# EAGLE design timelapse_cr_schematic (EAGLE 6.1)
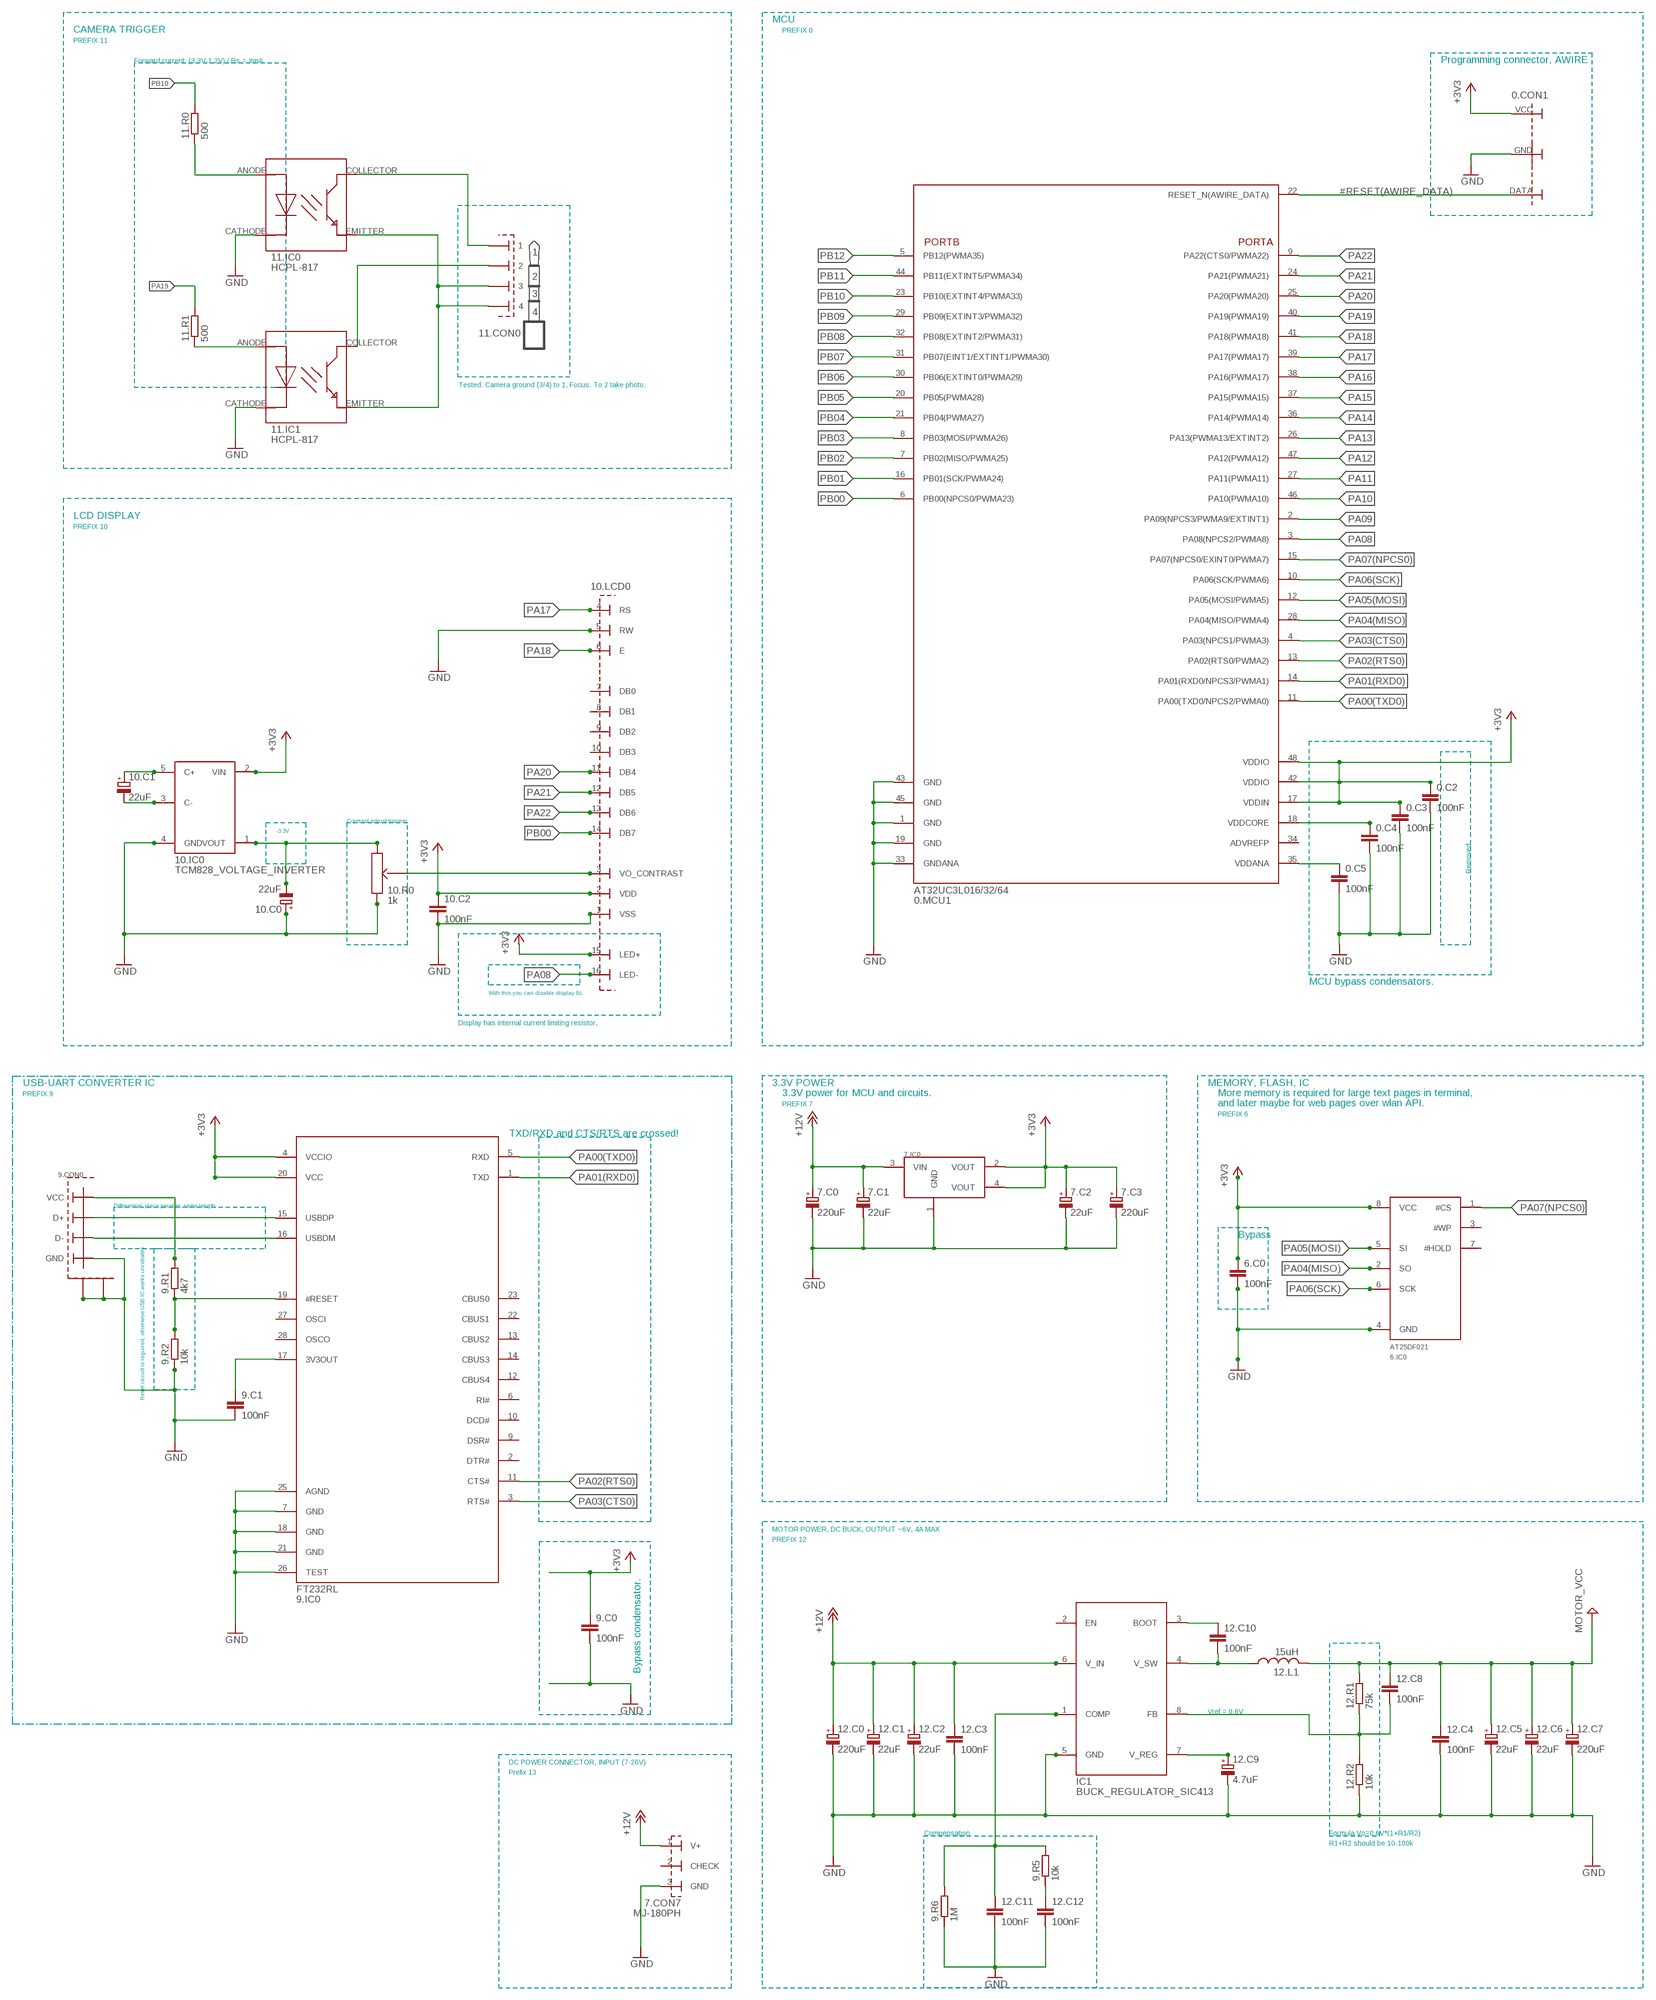
[diagram p0: schematic, sheet 1, part 1 of 2]
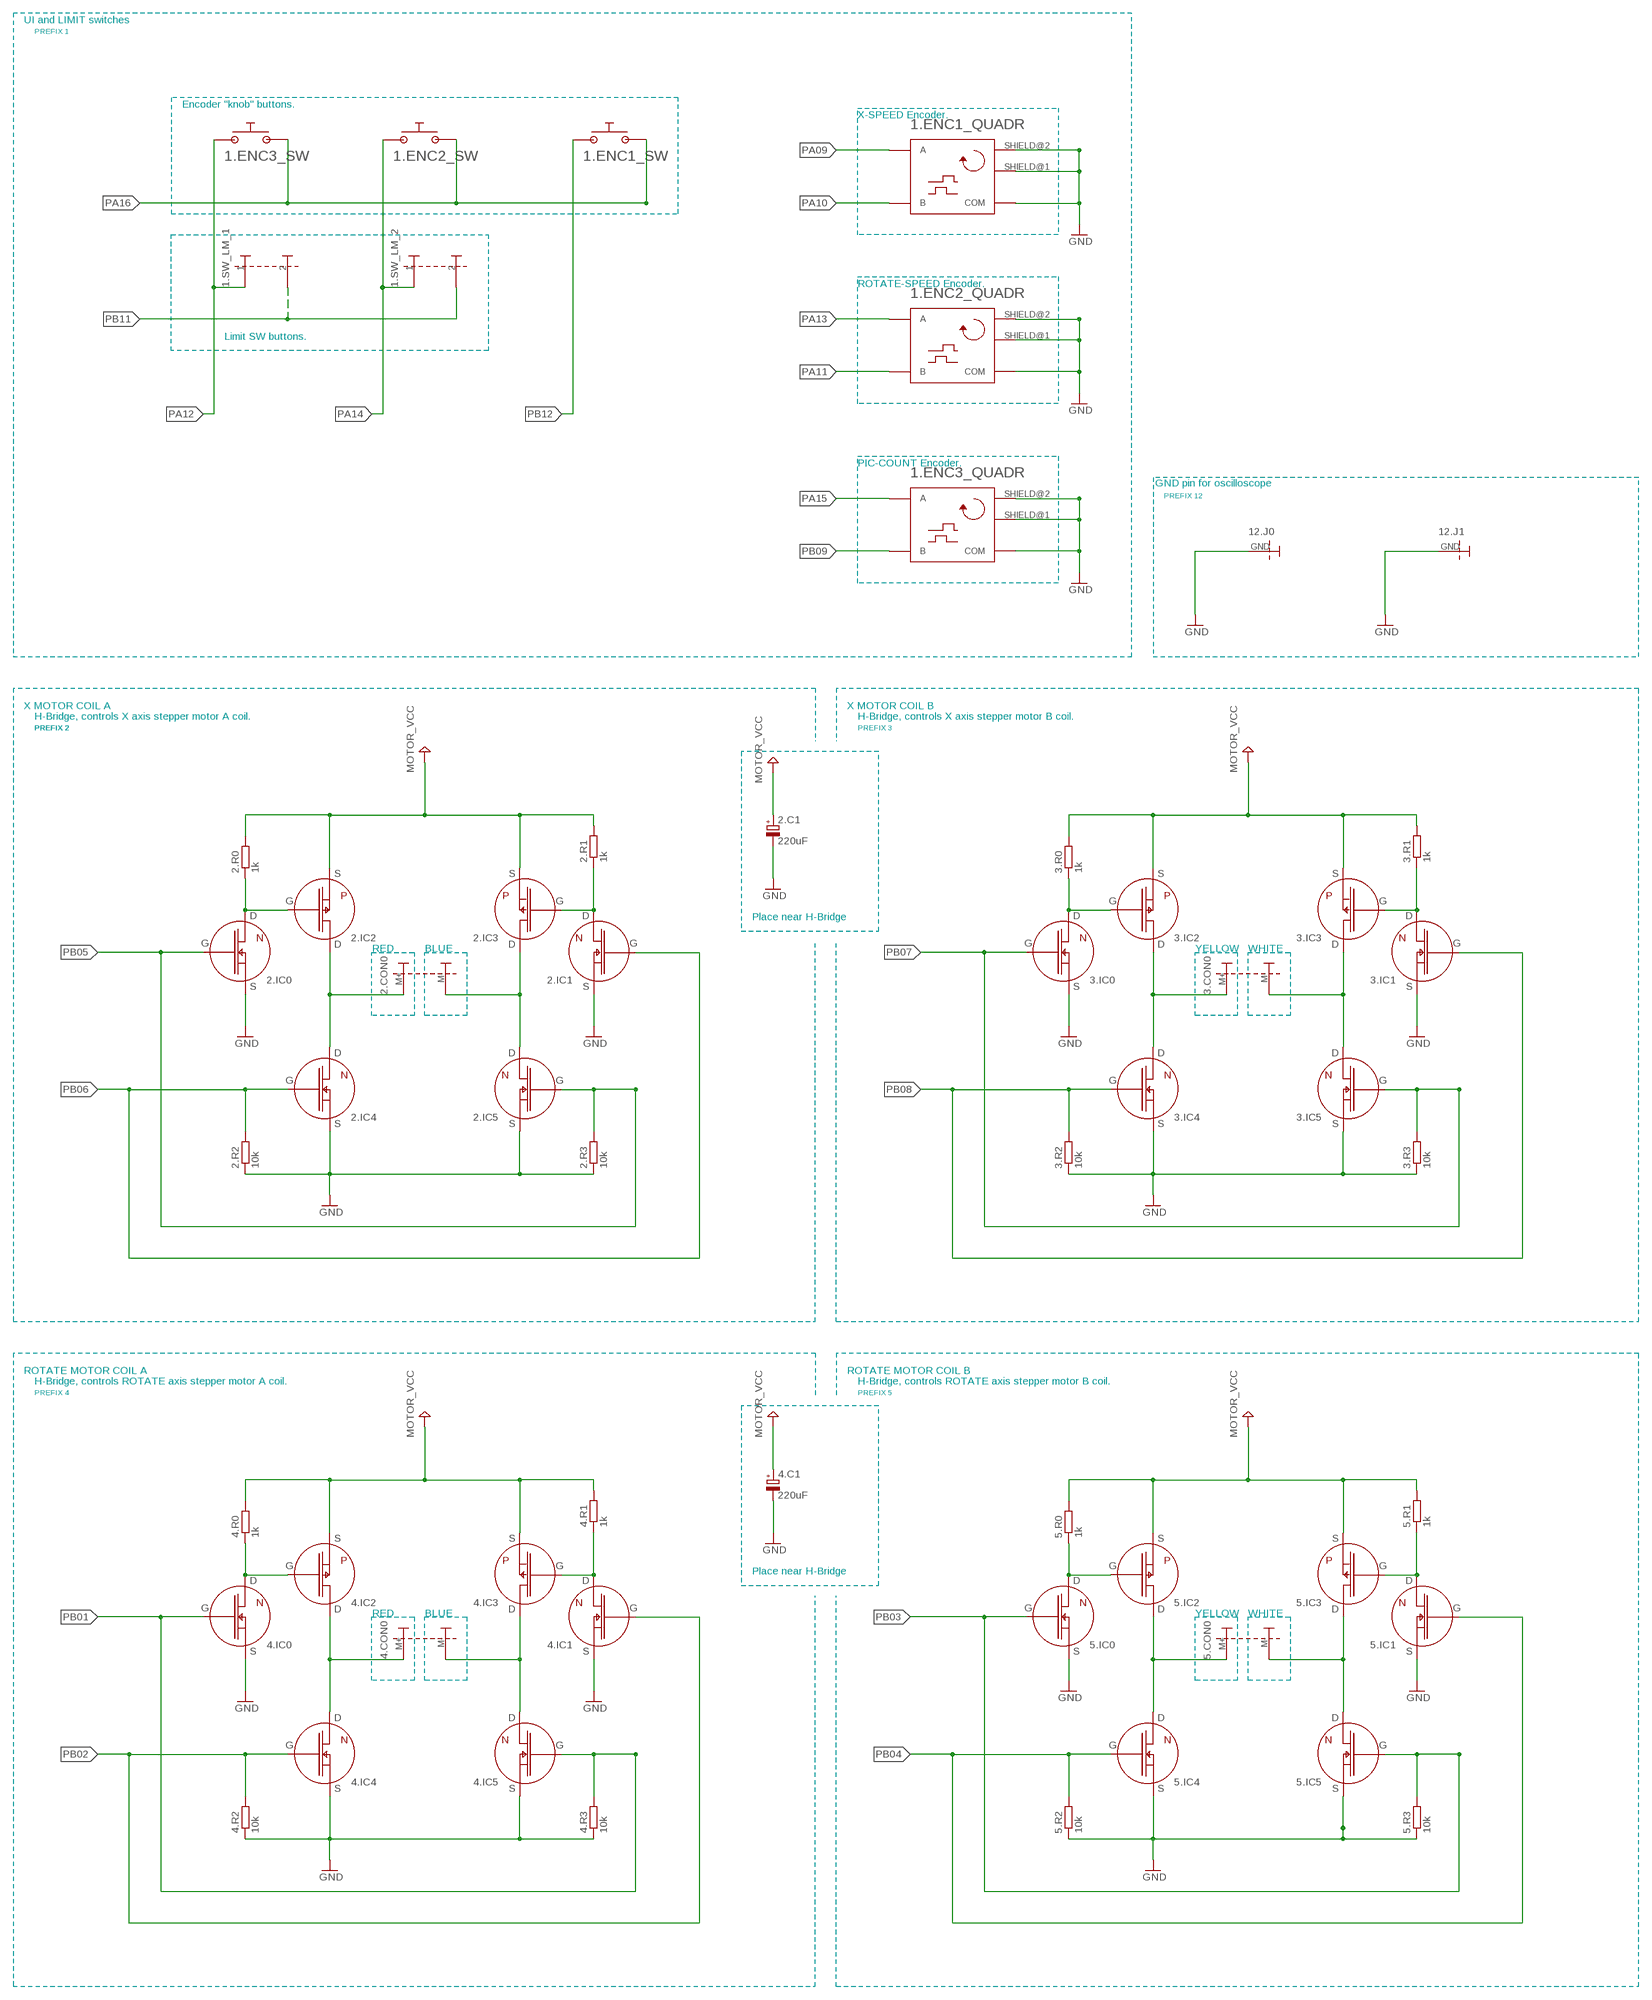
[diagram p1: schematic, sheet 1, part 2 of 2]

## Parts
0.C2  100nF  C-EUC0805  [C0805]
0.C3  100nF  C-EUC0805  [C0805]
0.C4  100nF  C-EUC0805  [C0805]
0.C5  100nF  C-EUC0805  [C0805]
0.CON1  CONNECTOR_3PINAWIRE  [1X3_AWIRE]
0.MCU1  AT32UCL016/32/64_TQFP48  [TQFP48]
1.ENC1  ENCODER_QUADRATE_WITH_BUTTON_ENCODER_PEC11-4XXXF-SXXXX  [ENCODER_PEC11-4XXXF-SXXXX]
1.ENC2  ENCODER_QUADRATE_WITH_BUTTON_ENCODER_PEC11-4XXXF-SXXXX  [ENCODER_PEC11-4XXXF-SXXXX]
1.ENC3  ENCODER_QUADRATE_WITH_BUTTON_ENCODER_PEC11-4XXXF-SXXXX  [ENCODER_PEC11-4XXXF-SXXXX]
1.SW_LM_1  CONNECTOR_2PIN  CONNECTOR_2PIN1X2_WIRE  [1X2_WIRE]
1.SW_LM_2  CONNECTOR_2PIN  CONNECTOR_2PIN1X2_WIRE  [1X2_WIRE]
2.C1  220uF  CPOL-EUE3.5-8  [E3,5-8]
2.CON0  CONNECTOR_2PIN1X2_MOTOR_COIL  [1X2_MOTOR_COIL_CONNECTOR]
2.IC0  N_MOSFET_TSM2N7002  [SOT23]
2.IC1  N_MOSFET_TSM2N7002  [SOT23]
2.IC2  P_MOSFET_NX2301P  [SOT23]
2.IC3  P_MOSFET_NX2301P  [SOT23]
2.IC4  N_MOSFET_PMV16UN  [SOT23]
2.IC5  N_MOSFET_PMV16UN  [SOT23]
2.R0  1k  R-EU_R0805  [R0805]
2.R1  1k  R-EU_R0805  [R0805]
2.R2  10k  R-EU_R0805  [R0805]
2.R3  10k  R-EU_R0805  [R0805]
3.CON0  CONNECTOR_2PIN1X2_MOTOR_COIL  [1X2_MOTOR_COIL_CONNECTOR]
3.IC0  N_MOSFET_TSM2N7002  [SOT23]
3.IC1  N_MOSFET_TSM2N7002  [SOT23]
3.IC2  P_MOSFET_NX2301P  [SOT23]
3.IC3  P_MOSFET_NX2301P  [SOT23]
3.IC4  N_MOSFET_PMV16UN  [SOT23]
3.IC5  N_MOSFET_PMV16UN  [SOT23]
3.R0  1k  R-EU_R0805  [R0805]
3.R1  1k  R-EU_R0805  [R0805]
3.R2  10k  R-EU_R0805  [R0805]
3.R3  10k  R-EU_R0805  [R0805]
4.C1  220uF  CPOL-EUE3.5-8  [E3,5-8]
4.CON0  CONNECTOR_2PIN1X2_MOTOR_COIL  [1X2_MOTOR_COIL_CONNECTOR]
4.IC0  N_MOSFET_TSM2N7002  [SOT23]
4.IC1  N_MOSFET_TSM2N7002  [SOT23]
4.IC2  P_MOSFET_NX2301P  [SOT23]
4.IC3  P_MOSFET_NX2301P  [SOT23]
4.IC4  N_MOSFET_PMV16UN  [SOT23]
4.IC5  N_MOSFET_PMV16UN  [SOT23]
4.R0  1k  R-EU_R0805  [R0805]
4.R1  1k  R-EU_R0805  [R0805]
4.R2  10k  R-EU_R0805  [R0805]
4.R3  10k  R-EU_R0805  [R0805]
5.CON0  CONNECTOR_2PIN1X2_MOTOR_COIL  [1X2_MOTOR_COIL_CONNECTOR]
5.IC0  N_MOSFET_TSM2N7002  [SOT23]
5.IC1  N_MOSFET_TSM2N7002  [SOT23]
5.IC2  P_MOSFET_NX2301P  [SOT23]
5.IC3  P_MOSFET_NX2301P  [SOT23]
5.IC4  N_MOSFET_PMV16UN  [SOT23]
5.IC5  N_MOSFET_PMV16UN  [SOT23]
5.R0  1k  R-EU_R0805  [R0805]
5.R1  1k  R-EU_R0805  [R0805]
5.R2  10k  R-EU_R0805  [R0805]
5.R3  10k  R-EU_R0805  [R0805]
6.C0  100nF  C-EUC0805  [C0805]
6.IC0  FLASH_AT25DF021_SO8  [SO8]
7.C0  220uF  CPOL-EUE3.5-8  [E3,5-8]
7.C1  22uF  CPOL-EUE1.5-5  [E1.5-5]
7.C2  22uF  CPOL-EUE1.5-5  [E1.5-5]
7.C3  220uF  CPOL-EUE3.5-8  [E3,5-8]
7.CON7  MJ-180PH  [MJ-180PH]
7.IC0  REGULATOR_AP1117E33G-13  [SOT223]
9.C0  100nF  C-EUC0805  [C0805]
9.C1  100nF  C-EUC0805  [C0805]
9.CON0  USB-BWUERTH-ELECTRONIC-USB-B  [USB-B-THROUGH-HOLE]
9.IC0  FT232RL  [SSOP28]
9.R1  4k7  R-EU_R0805  [R0805]
9.R2  10k  R-EU_R0805  [R0805]
9.R5  10k  R-EU_R0805  [R0805]
9.R6  1M  R-EU_R0805  [R0805]
10.C0  22uF  CPOL-EUE1.5-5  [E1.5-5]
10.C1  22uF  CPOL-EUE1.5-5  [E1.5-5]
10.C2  100nF  C-EUC0805  [C0805]
10.IC0  TCM828_VOLTAGE_INVERTER  [SOT23-5L]
10.LCD0  LCD_WITH_COMMON_INTERFACE_FDCC0802C-NSWBBH-91LE  [LCD_FDCC0802C-NSWBBH-91LE]
10.R0  1k  R-TRIMMER  [CT6V]
11.CON0  2.5MM-JACK-STEREO-CONNECTOR  [PSG01539]
11.IC0  HCPL-817  [HPCL-817]
11.IC1  HCPL-817  [HPCL-817]
11.R0  500  R-EU_R0805  [R0805]
11.R1  500  R-EU_R0805  [R0805]
12.C0  220uF  CPOL-EUE3.5-8  [E3,5-8]
12.C1  22uF  CPOL-EUE1.5-5  [E1.5-5]
12.C2  22uF  CPOL-EUE1.5-5  [E1.5-5]
12.C3  100nF  C-EUC0805  [C0805]
12.C4  100nF  C-EUC0805  [C0805]
12.C5  22uF  CPOL-EUE1.5-5  [E1.5-5]
12.C6  22uF  CPOL-EUE1.5-5  [E1.5-5]
12.C7  220uF  CPOL-EUE3.5-8  [E3,5-8]
12.C8  100nF  C-EUC0805  [C0805]
12.C9  4.7uF  CPOL-EUE1.5-5  [E1.5-5]
12.C10  100nF  C-EUC0805  [C0805]
12.C11  100nF  C-EUC0805  [C0805]
12.C12  100nF  C-EUC0805  [C0805]
12.J0  CONNECTOR_1PINGND_PIN  [1X1_GND_PIN]
12.J1  CONNECTOR_1PINGND_PIN  [1X1_GND_PIN]
12.L1  15uH  LMCBFS7330-150MU  [INDUCTOR_MCBFS7330]
12.R1  75k  R-EU_R0805  [R0805]
12.R2  10k  R-EU_R0805  [R0805]
IC1  BUCK_REGULATOR_SIC413  [SO8]

## Nets
#RESET(AWIRE_DATA): 0.CON1.DATA 0.MCU1.22(RESET_N(AWIRE_DATA))
+3V3 [3V3_LOGIC_POWER]: 0.C2.1 0.C3.1 0.CON1.VCC 0.MCU1.17(VDDIN) 0.MCU1.42(VDDIO) 0.MCU1.48(VDDIO) 6.C0.1 6.IC0.8(VCC) 7.C2.+ 7.C3.+ 7.IC0.2(VOUT) 7.IC0.4(VOUT) 9.C0.1 9.IC0.4(VCCIO) 9.IC0.20(VCC) 10.C2.1 10.IC0.2(VIN) 10.LCD0.2(VDD) 10.LCD0.15(LED+)
+12V [12V_POWER_TRACE]: 7.C0.+ 7.C1.+ 7.CON7.1(V+) 7.IC0.3(VIN) 12.C0.+ 12.C1.+ 12.C2.+ 12.C3.1 IC1.6(V_IN)
GND: 0.C2.2 0.C3.2 0.C4.2 0.C5.2 0.CON1.GND 0.MCU1.1(GND) 0.MCU1.19(GND) 0.MCU1.33(GNDANA) 0.MCU1.43(GND) 0.MCU1.45(GND) 1.ENC1.COMMON(_QUADR:COM) 1.ENC1.SHIELD@1(_QUADR:SHIELD) 1.ENC1.SHIELD@2(_QUADR:SHIELD) 1.ENC2.COMMON(_QUADR:COM) 1.ENC2.SHIELD@1(_QUADR:SHIELD) 1.ENC2.SHIELD@2(_QUADR:SHIELD) 1.ENC3.COMMON(_QUADR:COM) 1.ENC3.SHIELD@1(_QUADR:SHIELD) 1.ENC3.SHIELD@2(_QUADR:SHIELD) 2.C1.- 2.IC0.2(S) 2.IC1.2(S) 2.IC4.2(S) 2.IC5.2(S) 2.R2.1 2.R3.1 3.IC0.2(S) 3.IC1.2(S) 3.IC4.2(S) 3.IC5.2(S) 3.R2.1 3.R3.1 4.C1.- 4.IC0.2(S) 4.IC1.2(S) 4.IC4.2(S) 4.IC5.2(S) 4.R2.1 4.R3.1 5.IC0.2(S) 5.IC1.2(S) 5.IC4.2(S) 5.IC5.2(S) 5.R2.1 5.R3.1 6.C0.2 6.IC0.4(GND) 7.C0.- 7.C1.- 7.C2.- 7.C3.- 7.CON7.3(GND) 7.IC0.1(GND) 9.C0.2 9.C1.2 9.CON0.GND 9.CON0.SHIELD 9.CON0.SHIELD@2(SHIELD) 9.IC0.7(GND) 9.IC0.18(GND) 9.IC0.21(GND) 9.IC0.25(AGND) 9.IC0.26(TEST) 9.R2.1 9.R6.1 10.C0.+ 10.C2.2 10.IC0.4(GND) 10.LCD0.1(VSS) 10.LCD0.5(RW) 10.R0.3 11.IC0.CATHODE 11.IC1.CATHODE 12.C0.- 12.C1.- 12.C2.- 12.C3.2 12.C4.2 12.C5.- 12.C6.- 12.C7.- 12.C9.- 12.C11.2 12.C12.2 12.J0.GND 12.J1.GND 12.R2.1 IC1.5(GND)
MOTOR_VCC [MOTOR_PWR_TRACE]: 2.C1.+ 2.IC2.2(S) 2.IC3.2(S) 2.R0.2 2.R1.2 3.IC2.2(S) 3.IC3.2(S) 3.R0.2 3.R1.2 4.C1.+ 4.IC2.2(S) 4.IC3.2(S) 4.R0.2 4.R1.2 5.IC2.2(S) 5.IC3.2(S) 5.R0.2 5.R1.2 12.C4.1 12.C5.+ 12.C6.+ 12.C7.+ 12.C8.1 12.L1.P$2 12.R1.2
N$1: 9.C1.1 9.IC0.17(3V3OUT)
N$2: 2.IC0.3(D) 2.IC2.1(G) 2.R0.1
N$3: 9.CON0.D- 9.IC0.16(USBDM)
N$4: 9.CON0.D+ 9.IC0.15(USBDP)
N$5: 9.CON0.VCC 9.R1.2
N$6: 9.IC0.19(#RESET) 9.R1.1 9.R2.2
N$7: 3.IC0.3(D) 3.IC2.1(G) 3.R0.1
N$8: 2.IC1.3(D) 2.IC3.1(G) 2.R1.1
N$9 [MOTOR_PWR_COILS]: 2.CON0.M- 2.IC3.3(D) 2.IC5.3(D)
N$10 [MOTOR_PWR_COILS]: 2.CON0.M+ 2.IC2.3(D) 2.IC4.3(D)
N$11: 3.IC1.3(D) 3.IC3.1(G) 3.R1.1
N$12 [MOTOR_PWR_COILS]: 3.CON0.M- 3.IC3.3(D) 3.IC5.3(D)
N$13: 10.LCD0.3(VO_CONTRAST) 10.R0.2
N$14 [MOTOR_PWR_COILS]: 3.CON0.M+ 3.IC2.3(D) 3.IC4.3(D)
N$15: 11.CON0.1 11.CON0.4 11.IC0.EMITTER 11.IC1.EMITTER
N$16: 10.C1.+ 10.IC0.5(C+)
N$17: 10.C1.- 10.IC0.3(C-)
N$18: 4.IC0.3(D) 4.IC2.1(G) 4.R0.1
N$19: 4.IC1.3(D) 4.IC3.1(G) 4.R1.1
N$20 [MOTOR_PWR_COILS]: 4.CON0.M- 4.IC3.3(D) 4.IC5.3(D)
N$21 [MOTOR_PWR_COILS]: 4.CON0.M+ 4.IC2.3(D) 4.IC4.3(D)
N$22: 9.R5.2 9.R6.2 12.C11.1 IC1.1(COMP)
N$23: 10.C0.- 10.IC0.1(VOUT) 10.R0.1
N$24: 5.IC0.3(D) 5.IC2.1(G) 5.R0.1
N$25: 5.IC1.3(D) 5.IC3.1(G) 5.R1.1
N$26 [MOTOR_PWR_COILS]: 5.CON0.M- 5.IC3.3(D) 5.IC5.3(D)
N$27 [MOTOR_PWR_COILS]: 5.CON0.M+ 5.IC2.3(D) 5.IC4.3(D)
N$28 [3V3_LOGIC_POWER]: 0.C4.1 0.MCU1.18(VDDCORE)
N$29: 12.C10.1 IC1.3(BOOT)
N$30: 12.C8.2 12.R1.1 12.R2.2 IC1.8(FB)
N$31: 11.CON0.3 11.IC0.COLLECTOR
N$32 [MOTOR_PWR_COILS]: 12.C10.2 12.L1.P$1 IC1.4(V_SW)
N$33: 9.R5.1 12.C12.1
N$34: 11.CON0.2 11.IC1.COLLECTOR
N$35 [3V3_LOGIC_POWER]: 0.C5.1 0.MCU1.35(VDDANA)
N$36: 12.C9.+ IC1.7(V_REG)
N$37: 11.IC0.ANODE 11.R0.1
N$38: 11.IC1.ANODE 11.R1.1
PA00(TXD0): 0.MCU1.11(PA00(TXD0/NPCS2/PWMA0)) 9.IC0.5(RXD)
PA01(RXD0): 0.MCU1.14(PA01(RXD0/NPCS3/PWMA1)) 9.IC0.1(TXD)
PA02(RTS0): 0.MCU1.13(PA02(RTS0/PWMA2)) 9.IC0.11(CTS#)
PA03(CTS0): 0.MCU1.4(PA03(NPCS1/PWMA3)) 9.IC0.3(RTS#)
PA04(MISO): 0.MCU1.28(PA04(MISO/PWMA4)) 6.IC0.2(SO)
PA05(MOSI): 0.MCU1.12(PA05(MOSI/PWMA5)) 6.IC0.5(SI)
PA06(SCK): 0.MCU1.10(PA06(SCK/PWMA6)) 6.IC0.6(SCK)
PA07(NPCS0): 0.MCU1.15(PA07(NPCS0/EXINT0/PWMA7)) 6.IC0.1(#CS)
PA08: 0.MCU1.3(PA08(NPCS2/PWMA8)) 10.LCD0.16(LED-)
PA09: 0.MCU1.2(PA09(NPCS3/PWMA9/EXTINT1)) 1.ENC1.A(_QUADR:A)
PA10: 0.MCU1.46(PA10(PWMA10)) 1.ENC1.B(_QUADR:B)
PA11: 0.MCU1.27(PA11(PWMA11)) 1.ENC2.B(_QUADR:B)
PA12: 0.MCU1.47(PA12(PWMA12)) 1.ENC3.SW1 1.SW_LM_1.1
PA13: 0.MCU1.26(PA13(PWMA13/EXTINT2)) 1.ENC2.A(_QUADR:A)
PA14: 0.MCU1.36(PA14(PWMA14)) 1.ENC2.SW1 1.SW_LM_2.1
PA15: 0.MCU1.37(PA15(PWMA15)) 1.ENC3.A(_QUADR:A)
PA16: 0.MCU1.38(PA16(PWMA17)) 1.ENC1.SW2 1.ENC2.SW2 1.ENC3.SW2
PA17: 0.MCU1.39(PA17(PWMA17)) 10.LCD0.4(RS)
PA18: 0.MCU1.41(PA18(PWMA18)) 10.LCD0.6(E)
PA19: 0.MCU1.40(PA19(PWMA19)) 11.R1.2
PA20: 0.MCU1.25(PA20(PWMA20)) 10.LCD0.11(DB4)
PA21: 0.MCU1.24(PA21(PWMA21)) 10.LCD0.12(DB5)
PA22: 0.MCU1.9(PA22(CTS0/PWMA22)) 10.LCD0.13(DB6)
PB00: 0.MCU1.6(PB00(NPCS0/PWMA23)) 10.LCD0.14(DB7)
PB01: 0.MCU1.16(PB01(SCK/PWMA24)) 4.IC0.1(G) 4.IC5.1(G) 4.R3.2
PB02: 0.MCU1.7(PB02(MISO/PWMA25)) 4.IC1.1(G) 4.IC4.1(G) 4.R2.2
PB03: 0.MCU1.8(PB03(MOSI/PWMA26)) 5.IC0.1(G) 5.IC5.1(G) 5.R3.2
PB04: 0.MCU1.21(PB04(PWMA27)) 5.IC1.1(G) 5.IC4.1(G) 5.R2.2
PB05: 0.MCU1.20(PB05(PWMA28)) 2.IC0.1(G) 2.IC5.1(G) 2.R3.2
PB06: 0.MCU1.30(PB06(EXTINT0/PWMA29)) 2.IC1.1(G) 2.IC4.1(G) 2.R2.2
PB07: 0.MCU1.31(PB07(EINT1/EXTINT1/PWMA30)) 3.IC0.1(G) 3.IC5.1(G) 3.R3.2
PB08: 0.MCU1.32(PB08(EXTINT2/PWMA31)) 3.IC1.1(G) 3.IC4.1(G) 3.R2.2
PB09: 0.MCU1.29(PB09(EXTINT3/PWMA32)) 1.ENC3.B(_QUADR:B)
PB10: 0.MCU1.23(PB10(EXTINT4/PWMA33)) 11.R0.2
PB11: 0.MCU1.44(PB11(EXTINT5/PWMA34)) 1.SW_LM_1.2 1.SW_LM_2.2
PB12: 0.MCU1.5(PB12(PWMA35)) 1.ENC1.SW1
Unconnected: 0.MCU1.34(ADVREFP) 6.IC0.3(#WP) 6.IC0.7(#HOLD) 7.CON7.2(CHECK) 9.IC0.2(DTR#) 9.IC0.6(RI#) 9.IC0.9(DSR#) 9.IC0.10(DCD#) 9.IC0.12(CBUS4) 9.IC0.13(CBUS2) 9.IC0.14(CBUS3) 9.IC0.22(CBUS1) 9.IC0.23(CBUS0) 9.IC0.27(OSCI) 9.IC0.28(OSCO) 10.LCD0.7(DB0) 10.LCD0.8(DB1) 10.LCD0.9(DB2) 10.LCD0.10(DB3) IC1.2(EN)

## Notes on the sheet
- MCU | UI and LIMIT switches
- CAMERA TRIGGER | PREFIX 0 | PREFIX 1
- PREFIX 11
- Forward current: (3.3V-1.2V) / Rs = XmA | Programming connector, AWIRE
- Encoder "knob" buttons.
- X-SPEED Encoder.
- ROTATE-SPEED Encoder.
- Limit SW buttons.
- Tested: Camera ground (3/4) to 1, Focus. To 2 take photo.
- PIC-COUNT Encoder.
- GND pin for oscilloscope
- PREFIX 12
- LCD DISPLAY
- PREFIX 10
- X MOTOR COIL A | X MOTOR COIL B
- H-Bridge, controls X axis stepper motor A coil. | H-Bridge, controls X axis stepper motor B coil.
- PREFIX 2 | PREFIX 2 | PREFIX 3
- Contrast adjust trimmer.
- -3.3V
- Removed
- Place near H-Bridge
- RED | BLUE | YELLOW | WHITE
- MCU bypass condensators.
- With this you can disable display BL
- Display has internal current limiting resistor.
- USB-UART CONVERTER IC | 3.3V POWER | MEMORY, FLASH, IC
- PREFIX 9 | 3.3V power for MCU and circuits. | More memory is required for large text pages in terminal,
- PREFIX 7 | and later maybe for web pages over wlan API.
- PREFIX 6
- TXD/RXD and CTS/RTS are crossed!
- Differential, place paraller, same length
- Bypass
- ROTATE MOTOR COIL A | ROTATE MOTOR COIL B
- H-Bridge, controls ROTATE axis stepper motor A coil. | H-Bridge, controls ROTATE axis stepper motor B coil.
- PREFIX 4 | PREFIX 5
- Reset circuit is reguired, otherwise USB IC works unreliable.
- Place near H-Bridge
- MOTOR POWER, DC BUCK, OUTPUT ~6V, 4A MAX
- PREFIX 12
- RED | BLUE | YELLOW | WHITE
- Bypass condensator.
- Vref = 0.6V
- DC POWER CONNECTOR, INPUT (7-26V)
- Prefix 13
- Compensation | Formula Vo=0.6V*(1+R1/R2)
- R1+R2 should be 10-100k

## Library data of the parts
0.C2-0.C5 6.C0 9.C0 9.C1 10.C2 12.C3 12.C4 12.C8 12.C10-12.C12 = RC_and_L:C-EU: CAPACITOR, European symbol
0.CON1 = connectors:CONNECTOR_3PIN
0.MCU1 = tlcamera_rail_to_manufacture:AT32UCL016/32/64: Atmel AVR32 family, AT32UCL016-64. In Timelapse Camera Rail 64kBit version is used.; DATASHEET: http://www.farnell.com/datasheets/731602.pdf; FARNELL: http://fi.farnell.com/atmel/at32uc3l032-aut/mcu-32bit-32k-flash-uc3l-48tqfp/dp/1841644
1.ENC1-1.ENC3 = tlcamera_rail_to_manufacture:ENCODER_QUADRATE_WITH_BUTTON: ENCODER, QUADRATE OUTPUT, INCLUDED SWITCH; DATASHEET: http://www.bourns.com/data/global/pdfs/pec11.pdf; FARNELL: http://fi.farnell.com/bourns/pec11-4220f-s0012/increm-encoder-dual-60rpm-12mm/dp/1838961
1.SW_LM_1 1.SW_LM_2 2.CON0 3.CON0 4.CON0 5.CON0 = connectors:CONNECTOR_2PIN
2.C1 4.C1 7.C0 7.C1-7.C3 10.C0 10.C1 12.C0 12.C1 12.C2 12.C5-12.C7 12.C9 = RC_and_L:CPOL-EU: POLARIZED CAPACITOR, European symbol
2.IC0 2.IC1 3.IC0 3.IC1 4.IC0 4.IC1 5.IC0 5.IC1 = tlcamera_rail_to_manufacture:N_MOSFET: MOSFET, N CHANNEL, SINGLE, 3PIN; DATASHEET: http://www.farnell.com/datasheets/74204.pdf; FARNELL: http://fi.farnell.com/taiwan-semiconductor/tsm2n7002cx/mosfet-n-60v-sot-23/dp/1299313
2.IC2 2.IC3 3.IC2 3.IC3 4.IC2 4.IC3 5.IC2 5.IC3 = tlcamera_rail_to_manufacture:P_MOSFET: MOSFET, P CHANNEL; DATASHEET: http://www.nxp.com/documents/data_sheet/NX2301P.pdf; FARNELL: http://fi.farnell.com/nxp/nx2301p/mosfet-p-ch-20v-2a-sot23/dp/1894738?Ntt=NX2301P
2.IC4 2.IC5 3.IC4 3.IC5 4.IC4 4.IC5 5.IC4 5.IC5 = tlcamera_rail_to_manufacture:N_MOSFET: MOSFET, N CHANNEL, SINGLE, 3PIN; DATASHEET: http://www.nxp.com/documents/data_sheet/PMV16UN.pdf; FARNELL: http://fi.farnell.com/nxp/pmv16un/mosfet-n-ch-20v-5-8a-sot23/dp/1894627?Ntt=PMV16UN
2.R0 2.R1-2.R3 3.R0 3.R1-3.R3 4.R0 4.R1-4.R3 5.R0 5.R1-5.R3 9.R1 9.R2 9.R5 9.R6 11.R0 11.R1 12.R1 12.R2 = RC_and_L:R-EU_: RESISTOR, European symbol
6.IC0 = tlcamera_rail_to_manufacture:FLASH_AT25DF021: Atmel AT25DF021 Flash memory datachip.; DATASHEET: http://atmel.com/dyn/resources/prod_documents/doc3677.pdf; FARNELL: http://fi.farnell.com/atmel/at25df021-ssh-b/memory-dataflash-2m-spi-8soic/dp/1715438
7.CON7 = tlcamera_rail_to_manufacture:MJ-180PH: Power connector. MJ-180PH Farnell: Datasheet; DATASHEET: http://www.farnell.com/cad/654129.pdf; FARNELL: http://fi.farnell.com/multicomp/mj-180ph/socket-pcb-dc-power/dp/1737251?Ntt=MJ180-ph
7.IC0 = tlcamera_rail_to_manufacture:REGULATOR: 3V3 Fixed voltage regulator. (2 pins out).; DATASHEET: http://www.farnell.com/datasheets/608751.pdf; FARNELL: http://fi.farnell.com/diodes-inc/ap1117e33g-13/ic-ldo-reg-3-3v-sot223/dp/1825291
9.CON0 = tlcamera_rail_to_manufacture:USB-B: USB, type B connector.; DATASHEET: http://www.farnell.com/datasheets/1442182.pdf; FARNELL: http://fi.farnell.com/jsp/search/productdetail.jsp?SKU=1642035
9.IC0 = tlcamera_rail_to_manufacture:FT232RL: FTDI - FT232RL - IC, USB TO UART, SMD, SSOP28, 232; DATASHEET: http://www.farnell.com/datasheets/11529.pdf; FARNELL: http://fi.farnell.com/ftdi/ft232rl/ic-usb-to-uart-smd-ssop28-232/dp/1146032
10.IC0 = tlcamera_rail_to_manufacture:TCM828_VOLTAGE_INVERTER: MICROCHIP - TCM828ECT713 - IC, V CONV, 1.5~5.5V, 25MA, SOT23-5; DATASHEET: http://www.farnell.com/datasheets/77562.pdf; FARNELL: http://fi.farnell.com/jsp/search/productdetail.jsp?SKU=1627172
10.LCD0 = tlcamera_rail_to_manufacture:LCD_WITH_COMMON_INTERFACE: LCD, common 4/8 Bit data interface and LED backlight.; DATASHEET: http://www.farnell.com/datasheets/653647.pdf; FARNELL: http://fi.farnell.com/fordata/fdcc0802c-nswbbh-91le/disp-8x2-stn-neg-lcd-3v-wht-b-l/dp/1847925
10.R0 = tlcamera_rail_to_manufacture:R-TRIMMER: R, TRIMMER.; DATASHEET: http://ww1.microchip.com/downloads/en/DeviceDoc/21488a.pdf; FARNELL: http://fi.farnell.com/te-connectivity-citec/ct6v102n/trimmer-1k/dp/1227554
11.CON0 = tlcamera_rail_to_manufacture:2.5MM-JACK-STEREO-CONNECTOR: 2.5MM JACK STEREO PLUG CONNECTOR FEMALE.; DATASHEET: http://www.farnell.com/datasheets/320067.pdf; FARNELL: http://fi.farnell.com/pro-signal/psg01539/socket-2-5mm-jack-stereo/dp/1280745
11.IC0 11.IC1 = tlcamera_rail_to_manufacture:HCPL-817: OPTOCOUPLER, 4PIN; DATASHEET: http://www.farnell.com/datasheets/1266126.pdf; FARNELL: http://fi.farnell.com/avago-technologies/hcpl-817-060e/optocoupler-transistor-o-p/dp/1244550
12.J0 12.J1 = connectors:CONNECTOR_1PIN
12.L1 = tlcamera_rail_to_manufacture:L: MULTICOMP - MCBFS7330-150MU - INDUCTOR, 15UH, 20%, 5.3A; DATASHEET: http://www.farnell.com/datasheets/1323827.pdf; FARNELL: http://fi.farnell.com/jsp/search/productdetail.jsp?SKU=1864276
IC1 = tlcamera_rail_to_manufacture:BUCK_REGULATOR_SIC413: VISHAY SILICONIX - SIC413CB-T1-E3 - BUCK, SYNC, 4A, 26V, 8SO; DATASHEET: http://www.vishay.com/docs/69057/sic413.pdf; FARNELL: http://fi.farnell.com/jsp/search/productdetail.jsp?SKU=1890663

## Net classes
1 MOTOR_PWR_COILS: width 0.533 mm
2 MOTOR_PWR_TRACE: width 1.397 mm
3 12V_POWER_TRACE: width 0.762 mm
4 3V3_LOGIC_POWER: width 0.533 mm

## Board
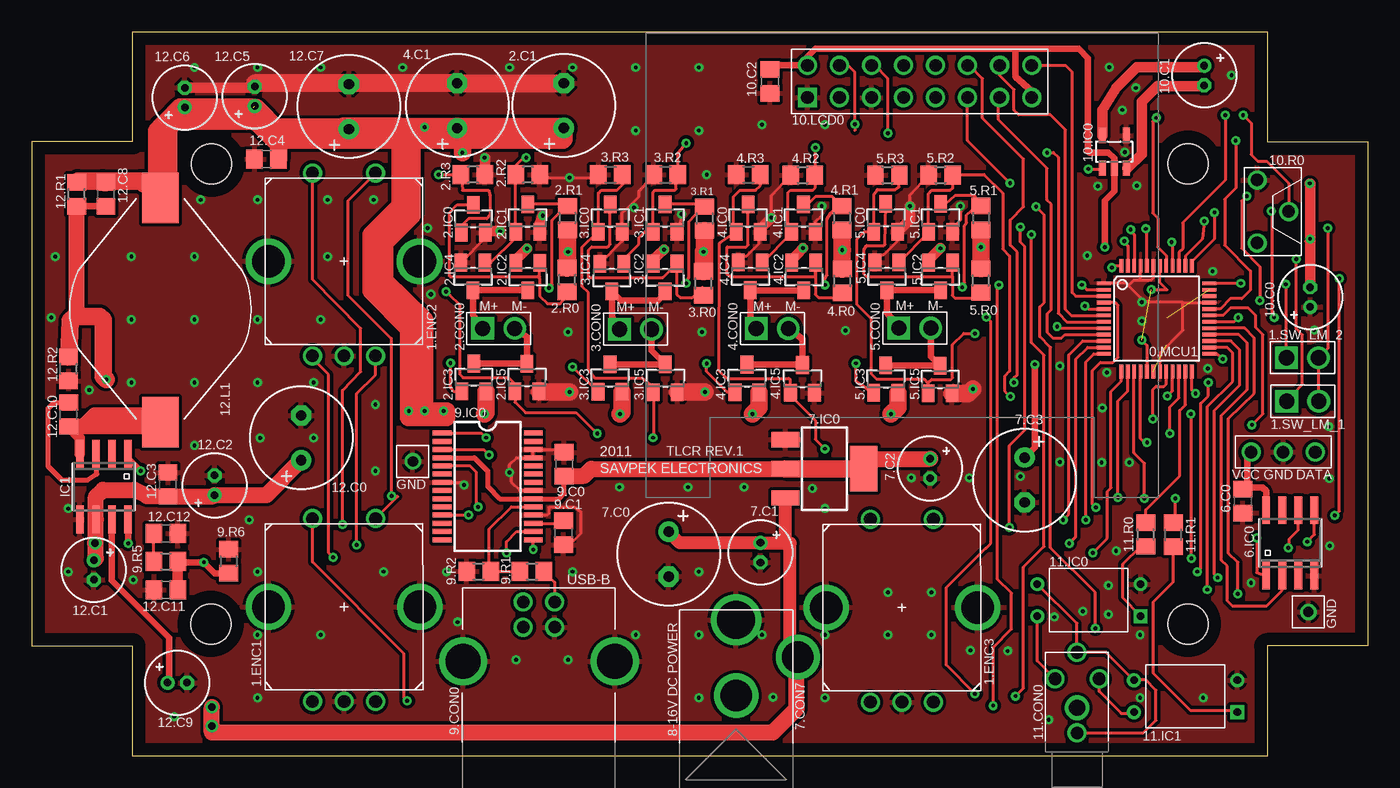
[diagram p2: board, top side]
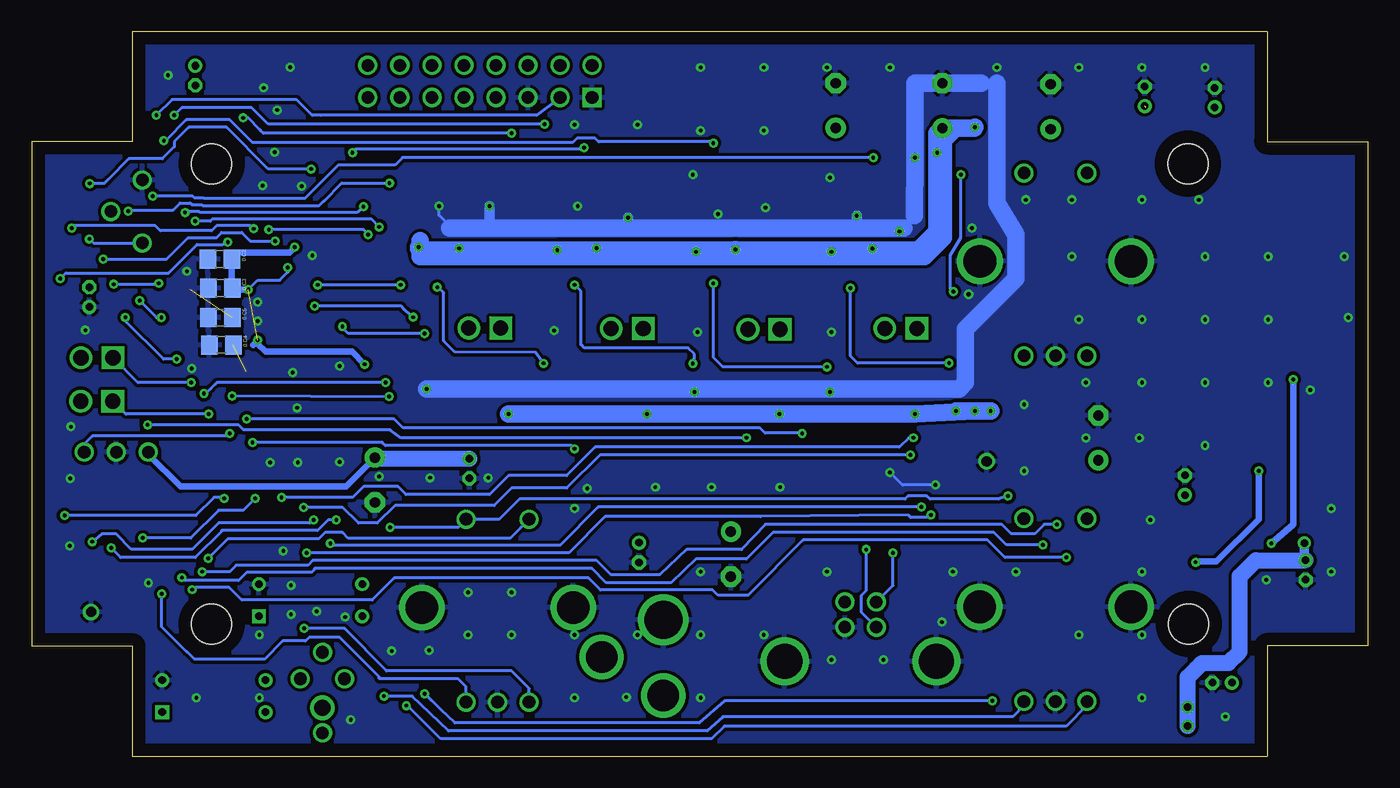
[diagram p3: board, bottom side, seen from below]

Size 105.99 x 57.48 mm. Coordinates in mm from the lower left corner, seen from the top.
Outline: 97.99,48.74 105.99,48.74 105.99,8.74 97.99,8.74 97.99,0 8,0 8,8.74 0,8.74 0,48.74 8,48.74 8,57.48 97.99,57.48 97.99,48.74
Copper layers (1*16): Top 0.035mm / dielectric 1.5mm / Bottom 0.035mm
Design rules: minimum track width 10mil, minimum drill 12mil, track to track 8mil, track to pad 8mil, pad to pad 8mil, via to via 8mil, smd to smd 8mil, copper to edge 40mil, drill to drill 8mil, minimum pad ring 10mil, minimum via ring 8mil, stop-mask expansion 4mil, vias tented up to drill 0mil, thermal gap 10mil
Holes 3.2 mm at 14.27,46.98 91.72,46.98 91.72,10.48 14.22,10.48

### Footprints (pad centres in the part's own frame; a part is rotated, then mirrored left to right if it is on the bottom)
C0805 = smd 1.3 x 1.5: 1 -0.95,0; 2 0.95,0
1X3_AWIRE = drill 1: DATA -2.54,0; GND 0,0; VCC 2.54,0
TQFP48 = smd 1.1 x 0.3: 1 -4.191,2.794; 2 -4.191,2.286; 3 -4.191,1.778; 4 -4.191,1.27; 5 -4.191,0.762; 6 -4.191,0.254; 7 -4.191,-0.254; 8 -4.191,-0.762; 9 -4.191,-1.27; 10 -4.191,-1.778; 11 -4.191,-2.286; 12 -4.191,-2.794; 25 4.191,-2.794; 26 4.191,-2.286; 27 4.191,-1.778; 28 4.191,-1.27; 29 4.191,-0.762; 30 4.191,-0.254; 31 4.191,0.254; 32 4.191,0.762; 33 4.191,1.27; 34 4.191,1.778; 35 4.191,2.286; 36 4.191,2.794 | smd 0.3 x 1.1: 13 -2.794,-4.191; 14 -2.286,-4.191; 15 -1.778,-4.191; 16 -1.27,-4.191; 17 -0.762,-4.191; 18 -0.254,-4.191; 19 0.254,-4.191; 20 0.762,-4.191; 21 1.27,-4.191; 22 1.778,-4.191; 23 2.286,-4.191; 24 2.794,-4.191; 37 2.794,4.191; 38 2.286,4.191; 39 1.778,4.191; 40 1.27,4.191; 41 0.762,4.191; 42 0.254,4.191; 43 -0.254,4.191; 44 -0.762,4.191; 45 -1.27,4.191; 46 -1.778,4.191; 47 -2.286,4.191; 48 -2.794,4.191
ENCODER_PEC11-4XXXF-SXXXX = drill 1: A -2.5,-7.5; B 2.5,-7.5; COMMON 0,-7.5; SW1 -2.5,7; SW2 2.5,7 | drill 2.6: SHIELD@1 -6,0; SHIELD@2 6,0
1X2_WIRE = drill 1.2 square: 1 -1.27,0 | drill 1.2: 2 1.27,0
E3,5-8 = drill 0.813 pad 1.6: + -1.778,0 | drill 0.813 pad 1.6 octagon: - 1.778,0
1X2_MOTOR_COIL_CONNECTOR = drill 1.2 square: M+ -1.27,0 | drill 1.2: M- 1.27,0
SOT23 = smd 1 x 1.4: 1 -0.95,-1.1; 2 0.95,-1.1; 3 0,1.1
R0805 = smd 1.3 x 1.5: 1 -0.95,0; 2 0.95,0
SO8 = smd 0.6 x 2.2: 1 -1.905,-2.6; 2 -0.635,-2.6; 3 0.635,-2.6; 4 1.905,-2.6; 5 1.905,2.6; 6 0.635,2.6; 7 -0.635,2.6; 8 -1.905,2.6
E1.5-5 = drill 0.6: + -0.77,0 | drill 0.6 octagon: - 0.79,0
MJ-180PH = drill 2.5: 1 10.75,-4.9; 2 7.7,0 | drill 3: 3 13.7,0
SOT223 = smd 1.219 x 2.235: 1 -2.311,-3.099; 2 0,-3.099; 3 2.311,-3.099 | smd 3.6 x 2.2: 4 0,3.099
USB-B-THROUGH-HOLE = drill 1: D+ 7.27,-2.71; D- 7.27,-4.71; GND 4.77,-2.71; VCC 4.77,-4.71 | drill 2.8: SHIELD 0,0; SHIELD@2 12.04,0
SSOP28 = smd 0.4 x 1.5: 1 -4.225,-3.625; 2 -3.575,-3.625; 3 -2.925,-3.625; 4 -2.275,-3.625; 5 -1.625,-3.625; 6 -0.975,-3.625; 7 -0.325,-3.625; 8 0.325,-3.625; 9 0.975,-3.625; 10 1.625,-3.625; 11 2.275,-3.625; 12 2.925,-3.625; 13 3.575,-3.625; 14 4.225,-3.625; 15 4.225,3.625; 16 3.575,3.625; 17 2.925,3.625; 18 2.275,3.625; 19 1.625,3.625; 20 0.975,3.625; 21 0.325,3.625; 22 -0.325,3.625; 23 -0.975,3.625; 24 -1.625,3.625; 25 -2.275,3.625; 26 -2.925,3.625; 27 -3.575,3.625; 28 -4.225,3.625
SOT23-5L = smd 0.55 x 1.2: 1 -0.95,-1.3; 2 0,-1.3; 3 0.95,-1.3; 4 0.95,1.3; 5 -0.95,1.3
LCD_FDCC0802C-NSWBBH-91LE = drill 1 square: 1 -1.27,0 | drill 1: 2 -1.27,2.54; 3 1.27,0; 4 1.27,2.54; 5 3.81,0; 6 3.81,2.54; 7 6.35,0; 8 6.35,2.54; 9 8.89,0; 10 8.89,2.54; 11 11.43,0; 12 11.43,2.54; 13 13.97,0; 14 13.97,2.54; 15 16.51,0; 16 16.51,2.54
CT6V = drill 1: 1 2.5,2.5; 2 0,0; 3 2.5,-2.5
PSG01539 = drill 1: 1 1.5,0; 2 5.8,-1.75; 3 5.8,1.75; 4 7.9,0 | drill 1.3: 5 3.5,0
HPCL-817 = drill 0.6 square: ANODE -1.27,0 | drill 0.6: CATHODE 1.27,0; COLLECTOR -1.27,8.2; EMITTER 1.27,8.2
1X1_GND_PIN = drill 0.8: GND 0,0
INDUCTOR_MCBFS7330 = smd 4 x 2.9: P$1 -8.44,-0.6; P$2 9.34,-0.6

### Placement (x,y rotation side)
0.C2  91.06,39.42 180 bottom
0.C3  91.03,37.12 180 bottom
0.C4  90.95,32.62 180 bottom
0.C5  91.02,34.77 180 bottom
0.CON1  99.27,24.12 180 top
0.MCU1  89.23,34.7 0 top
1.ENC1  24.79,11.84 0 top
1.ENC2  24.78,39.25 0 top
1.ENC3  69.03,11.78 0 top
1.SW_LM_1  100.82,28.15 0 top
1.SW_LM_2  100.8,31.6 0 top
2.C1  42.22,51.61 90 top
2.CON0  37.05,33.93 0 top
2.IC0  35.04,42.63 0 top
2.IC1  39.35,42.68 0 top
2.IC2  39.37,38.04 180 top
2.IC3  35.08,30.04 0 top
2.IC4  35.01,38.05 180 top
2.IC5  39.29,30.03 0 top
2.R0  42.48,37.78 90 top
2.R1  42.51,42.68 270 top
2.R2  39.36,46.12 180 top
2.R3  35.01,46.12 180 top
3.CON0  47.9,33.86 0 top
3.IC0  45.9,42.68 0 top
3.IC1  50.24,42.68 0 top
3.IC2  50.24,37.97 180 top
3.IC3  45.88,29.99 0 top
3.IC4  46.02,37.96 180 top
3.IC5  50.27,29.97 0 top
3.R0  53.29,37.49 90 top
3.R1  53.38,42.64 270 top
3.R2  50.29,46.11 0 top
3.R3  45.91,46.12 0 top
4.C1  33.76,51.6 90 top
4.CON0  58.75,33.91 0 top
4.IC0  56.83,42.68 0 top
4.IC1  61.22,42.68 0 top
4.IC2  61.26,38.04 180 top
4.IC3  56.74,29.96 0 top
4.IC4  57.01,38.06 180 top
4.IC5  61.14,29.92 0 top
4.R0  64.3,37.69 90 top
4.R1  64.27,42.68 270 top
4.R2  61.16,46.1 0 top
4.R3  56.85,46.11 0 top
5.CON0  70.05,33.96 0 top
5.IC0  67.75,42.7 0 top
5.IC1  72.09,42.7 0 top
5.IC2  72.1,38.05 180 top
5.IC3  67.75,29.91 0 top
5.IC4  67.84,38.06 180 top
5.IC5  72.06,29.87 0 top
5.R0  75.29,37.72 90 top
5.R1  75.3,42.69 270 top
5.R2  72.09,46.1 0 top
5.R3  67.88,46.1 0 top
6.C0  96.06,20.23 270 top
6.IC0  99.83,16.91 0 top
7.C0  50.53,16.02 270 top
7.C1  57.81,16.15 270 top
7.C2  71.27,22.82 270 top
7.C3  78.76,21.9 270 top
7.CON7  55.88,-2.89 90 top
7.IC0  62.9,22.79 270 top
9.C0  42.25,23.15 90 top
9.C1  42.19,17.72 270 top
9.CON0  46.26,7.51 180 top
9.IC0  36.17,21.39 270 top
9.R1  39.69,14.63 0 top
9.R2  35.47,14.63 0 top
9.R5  10.66,15.43 0 top
9.R6  15.63,15.46 270 top
10.C0  101.4,36.4 90 top
10.C1  93,54 270 top
10.C2  58.57,53.53 270 top
10.IC0  85.87,47.93 0 top
10.LCD0  62.81,52.25 0 top
10.R0  99.7,43.2 180 top
11.CON0  82.92,0.33 90 top
11.IC0  87.96,12.37 90 top
11.IC1  95.63,4.75 90 top
11.R0  88.37,17.58 90 top
11.R1  90.55,17.55 90 top
12.C0  21.39,25.25 90 top
12.C1  4.95,14.77 270 top
12.C2  14.51,21.48 90 top
12.C3  10.82,21.55 90 top
12.C4  18.63,47.35 180 top
12.C5  17.71,52.33 90 top
12.C6  12.15,52.23 90 top
12.C7  25.17,51.52 90 top
12.C8  5.9,44.56 270 top
12.C9  11.55,5.82 0 top
12.C10  2.94,27.1 270 top
12.C11  10.67,13.18 180 top
12.C12  10.65,17.66 0 top
12.J0  30.24,23.37 0 top
12.J1  101.27,11.43 90 top
12.L1  9.62,34.93 90 top
12.R1  3.57,44.57 90 top
12.R2  2.93,30.72 90 top
IC1  5.74,21.37 180 top

### Tracks (layer width: path | path; a pad name or v marks a point on that pad's centre or on a via)
#RESET(AWIRE_DATA)  (via drill 0.3)
  Top 0.254: 0.MCU1.22 91,28.41 90.27,27.68 v90.27,25.58
  Bottom 0.254: 0.CON1.DATA 101.92,24.23 101.92,24.63 101.17,25.38 90.47,25.38 v90.27,25.58
+3V3  (via drill 0.3)  (1 unrouted)
  Top 0.254: 0.MCU1.42 89.48,37.57 90.06,36.99 88.81,36.99 | 0.MCU1.17 88.46,32.59 v88.05,33 | 0.MCU1.48 85.81,38.9 v85.67,38.75
  Top 0.4: 37.14,20.41 9.IC0.20 41.83,20.41
  Top 0.406: 37.14,20.41 36.17,21.38 36.17,22.63 35.14,23.66 9.IC0.4 | 9.C0.1 42.25,20.83 41.83,20.41
  Top 0.533: 7.C3.+ 78.67,23.59 | 7.IC0.4 66.8,23.59 | 10.C2.1 58.88,54.79 10.LCD0.2 61.54,55.5 62.17,56.13 78.05,56.13 | v88.8,37 88.81,36.99 | 7.C3.+ 78.67,23.77 | 9.C0.1 42.32,22.13 | 10.LCD0.15 79.32,52.73 78.05,53.88 78.05,56.13 | 78.05,56.13 83.05,56.13 83.8,55.38 83.8,48 83.92,47.88 85.42,47.88 85.87,47.43 10.IC0.2 85.87,44.83 85.12,44.08 v85.12,40.38 | v79.57,31.08 79.57,24.49 7.C3.+ | 0.CON1.VCC 96.42,23.81 96.42,21.13 95.61,21.13 6.C0.1 96.21,21.33 97.62,21.33 97.93,21.02 6.IC0.8
  Top 1.27: 66.8,23.59 7.C2.+ | 7.IC0.2 44.38,22.79 43.82,22.23 42.28,22.23 9.C0.1
  Top 1.397: 7.IC0.2 7.IC0.4
  Bottom 0.254: v85.67,38.75 85.67,38.38 86.3,37.75 88.05,37.75 v88.8,37
  Bottom 0.533: 0.CON1.VCC 96.73,23.94 94.17,21.38 81.06,21.38 7.C3.+ 78.67,23.59 | 90.07,37.11 0.C3.1 | 88.43,32.62 v88.05,33 88.05,32.7 87.42,32.08 80.57,32.08 v79.57,31.08 | 0.C3.1 90.11,37.15 0.C2.1 90.05,39.48 90.05,39.96 85.54,39.96 v85.12,40.38 | v88.8,37 89.96,37 0.C3.1
  Bottom 1.27: 7.C2.+ 78.67,23.59
+12V  (via drill 0.6)
  Top 0.762: 12.C1.+ 5.11,15.69 | 14.4,20.6 12.C2.+ | 57.81,16.88 7.C1.+ | 60.17,16.88 59.8,17.25
  Top 1.016: 57.81,16.88 60.17,16.88 60.17,8.47 7.CON7.1 | 7.C1.+ 51.41,16.92 7.C0.+ | 59.8,17.25 7.IC0.3
  Top 1.27: 5.11,15.69 IC1.6 5.11,20.56 5.67,21.13 8.17,21.13 9.17,20.63 9.79,20.63 12.C3.1 14.4,20.6 | 12.C2.+ 18.63,20.71 12.C0.+ | 7.CON7.1 60.67,7.75 60.67,3.75 58.8,1.88 14.3,1.88 v14.3,2.38 v14.3,3.88 | v5.05,16.9 5.05,15.63
  Bottom 0.762: 12.C1.+ 5.05,15.63 v5.05,16.9 | 13.67,6.88 13.17,7.38
  Bottom 1.27: 12.C1.+ 8.89,15.54 10.17,14.25 10.17,8.28 11.07,7.38 13.17,7.38 13.62,6.93 | v14.3,2.38 14.3,6.25 13.67,6.88
GND  (via drill 0.3, 0.33)
  Top 0.254: v42.67,45.88 42.75,45.96 | 2.R2.1 40.35,45.88 44.72,45.88 3.R3.1 | 3.IC4.2 46.85,40.84 3.IC0.2 46.85,43.06 47.17,43.38 | v51.55,43 51.55,42.56 3.IC1.2 | 42.22,53.38 2.C1.- | 25.17,53.38 12.C7.- | 12.C6.- 12.15,53.12 | 17.71,53.38 12.C5.- | 35.99,41.63 2.IC0.2 35.99,41.08 2.IC4.2 | v35.92,47.48 35.96,47.44 | 2.IC5.2 40.29,28.88 | 56.06,39.27 4.IC4.2 56.53,39.63 56.67,39.63 57.67,40.63 57.67,41.47 4.IC0.2 | v62.67,43.63 62.67,42.88 62.17,42.38 4.IC1.2 62.17,41.88 | 47.17,43.38 48.17,44.38 48.17,44.82 3.R2.1 | 47.17,43.38 47.67,43.38 v47.8,43.5 | 5.IC0.2 68.65,40.83 67.59,39.77 67.42,39.72 5.IC4.2 | 5.IC1.2 73.04,41.91 73.65,42.52 73.65,43.61 v73.67,43.63 | v69.67,43.63 69.67,44.52 5.R2.1 | v58.68,42.72 58.68,44.48 4.R2.1 | 86.98,37.32 88.05,36.25 v88.05,36 91.3,36 91.33,35.97 | 86.98,37.32 86.8,37.5 0.MCU1.1 | 91.33,35.97 91.33,33.78 89.48,31.94 0.MCU1.19 | 91.33,35.97 0.MCU1.33 | 0.MCU1.43 88.97,37.93 88.8,37.75 87.92,37.75 | 87.92,37.75 87.42,37.75 86.98,37.32 | 0.MCU1.45 87.96,37.79 87.92,37.75 | 9.IC0.7 34.09,21.71 v34.3,21.5 | 9.C0.2 42.04,24.31 9.IC0.26 9.IC0.25 38.46,23.66 37.92,23.13 v37.92,22.5 38.05,22.38 38.05,21.75 38.74,21.06 9.IC0.21 | 9.C1.2 42.81,16.89 43.55,17.63 43.55,19.38 43.05,19.75 41.05,19.75 41.05,19.25 40.92,19.13 9.IC0.18
  Top 0.813: v37.17,41.63 35.99,41.63 | 2.IC1.2 40.3,42.26 v40.55,42.88 | 35.96,47.44 2.R3.1 | 4.IC0.2 57.78,41.82 v58.68,42.72 | 5.IC0.2 69.67,42.56 v69.67,43.63 | 12.C6.- 17.71,53.02 12.C5.-
  Top 1.397: 3.IC5.2 52.16,28.87 v53.42,28.88 | 40.29,28.88 v42.67,28.88 | 5.IC5.2 74.31,28.77 v74.67,29.13
  Top 1.422: 42.22,53.38 4.C1.- 25.17,53.38 17.71,53.38
  Bottom 0.254: 37.17,41.53 v37.17,41.63 35.98,42.82 35.98,42.88 | 41.22,41.88 40.92,41.78 | 40.72,41.88 40.55,41.65 | 29.42,53.38 30.67,53.38 | v73.67,43.63 73.67,42.9 72.65,41.88 | v34.3,21.5 36.92,21.5 v37.92,22.5
  Bottom 0.813: 40.55,41.65 v40.55,42.88 | 58.73,41.88 v58.68,42.72 | v69.67,43.63 69.67,42.18 69.07,41.88
  Bottom 1.397: 4.C1.- 35.67,53.38 35.92,53.38 | 35.92,53.38 v35.92,47.48 35.98,42.88 | 36.79,41.88 40.72,41.88 41.22,41.88 58.73,41.88 69.07,41.88 72.65,41.88 72.82,41.88 | 30.67,53.38 35.92,53.38 | 29.42,53.38 29.42,43.88 27.92,41.38 27.92,37.88 31.92,33.88 31.92,29.63 32.42,29.13 v74.67,29.13
  other vias: 17.92,4.63 22.92,9.63 17.92,14.63 2.92,14.63 27.92,14.63 17.92,9.63 33.8,10.63 32.92,14.63 17.27,18.73 2.92,19.63 12.92,24.63 18.12,25.23 22.37,25.23 27.27,22.63 42.92,14.63 47.92,9.63 42.55,7.63 38.42,7.63 52.92,4.63 52.92,9.63 52.92,14.63 57.92,9.63 58.82,4.68 62.92,4.63 62.92,9.63 67.92,9.63 77.42,8.33 74.47,8.38 80.67,2.88 87.92,9.63 87.92,4.63 92.92,4.63 96.72,13.73 102.97,16.68 62.92,19.63 102.92,22.03 7.92,29.63 12.92,29.63 17.92,29.63 22.37,29.63 27.27,27.88 64.55,33.75 31.67,36.63 93.3,30.75 31.42,41.88 23.47,39.63 12.92,39.63 7.92,39.63 7.92,34.63 12.92,34.63 17.92,34.63 22.92,34.63 13.42,44.13 17.92,44.13 23.47,44.13 47.92,49.63 52.92,49.63 57.92,50.08 62.92,50.08 86.52,51.25 12.92,54.63 17.92,54.63 22.92,54.63 29.42,54.63 37.92,54.63 42.92,54.63 47.92,54.63 52.92,54.63 53.17,33.63 42.55,33.63 53.55,46.13 8.07,13.98 83.72,39.7 87.67,45.25 84.57,45.2 86.72,47.9 85.47,54.65 95.17,54 93.67,38.45 88.05,34.5 102.87,26.13 101.72,33.78 74.37,22.08 61.92,21.23 78.42,22.18 1.87,39.63 1.57,34.78 4.57,29.03 11.32,3.13 56.52,21.33 52.07,21.33 46.62,21.33 69.77,22.08 67.92,12.98 71.37,12.98 71.37,9.63 87.57,53 85.42,13.53 85.42,11.23 86.02,16.28 81.12,11.03 83.37,11.48 85.27,30.43 84.92,27.63 81.57,30.93 81.57,23.33 84.87,23.28 87.07,23.28 27.12,44.13
  pour Top (isolate 0.254): -4.58,59.63 -4.58,-5.37 107.92,-5.37 107.92,59.63
  pour Bottom (isolate 0.254): -7.08,62.13 -7.08,-7.87 110.42,-7.87 110.42,62.13
MOTOR_VCC  (via drill 0.3)  (2 unrouted)
  Top 0.813: 2.IC2.2 38.42,39.38 v39.3,40.25 | 2.R0.2 42.48,38.82 v42.55,40 | 3.IC2.2 49.29,39.37 v50.17,40.18 | 4.IC2.2 60.31,39.33 v61.17,40.29 | 5.IC2.2 71.15,39.35 v72.07,40.28
  Top 1.397: 33.77,49.83 4.C1.+ | 24.72,49.83 24.67,49.88 25.03,49.88 12.C7.+ | 10.67,45.88 10.67,44.17 12.L1.P$2 10.47,44.08 9.92,45.38 | 10.67,45.88 10.67,50.38 11.75,51.46 12.C6.+ 17.61,51.46 | 9.92,45.38 8.92,45.38 8.67,45.63 5.67,45.63 | 5.67,45.63 3.68,45.63 12.R1.2 | 12.C8.1 5.79,45.51 5.67,45.63 | 2.IC3.2 36.03,27.24 v35.92,27.13 | 3.IC3.2 46.83,27.29 v46.67,27.13 | 4.IC3.2 57.69,27.65 v57.17,27.13 | 5.IC3.2 68.7,27.66 v68.17,27.13 | 5.R1.2 v75.3,40.38 75.3,39.18 5.R0.2 | 53.38,38.53 3.R1.2 | 53.38,38.53 3.R0.2 | 2.R1.2 42.51,38.76 2.R0.2 | 64.27,40.1 4.R1.2 | 4.R0.2 64.27,38.65 64.27,40.1 | v64.3,40.13 64.27,40.1 | 29.23,43.67 29.23,49.83 | 29.23,43.67 29.23,42.68 28,41.45 28,37.7 | 28,37.7 28.05,37.63 29.92,35.75 29.92,33.88 | 29.92,33.88 29.92,28.48 | 2.C1.+ 42.22,48.93 42.17,48.88 30.94,48.88 | 30.94,48.88 30.17,48.88 | 30.17,48.88 30.17,42.88 27.92,40.63 | 29.23,43.67 29.21,43.67 26.92,41.38 26.92,36.88 29.92,33.88 | 28,37.7 31.17,34.63 v31.17,27.38 | 9.92,45.38 9.92,49.63 10.42,50.13 | v29.92,27.38 29.92,28.38 30.17,28.38 v31.17,27.38 | v29.92,27.38 29.92,27.13 | 29.92,27.13 30.92,27.13 | 29.92,27.13 29.92,26.88 32.92,26.88 32.92,27.38 v32.67,27.38 v31.17,27.38 | v29.92,27.38 v31.17,27.38 | 53.38,38.53 53.3,38.53 v53.3,40 | v31.17,49.88 32.17,49.88 | v34.17,47.88 34.17,49.38 33.92,49.63 33.67,49.63 | 10.67,45.88 10.94,45.88 10.87,45.73 10.87,49.65 10.94,49.8 | 11.41,50.37 17.73,50.37 18.95,49.15 19.6,49.15 | 19.6,49.15 30.67,49.15 30.94,48.88 | 30.17,48.88 19.24,48.88 18.77,49.35 | 12.C4.1 19.58,49.13 19.6,49.15 | 17.62,51.42 17.85,51.42 19.53,49.74
  Top 1.676: 2.C1.+ 33.77,49.83 29.23,49.83 24.72,49.83 | 12.C7.+ 19.53,49.74
  Bottom 0.406: v61.17,40.29 64.3,40.29 v64.3,40.13
  Bottom 0.533: 39.3,40.13 42.55,40.13 v42.55,40
  Bottom 0.813: 74.92,39.88 72.47,39.88 v72.07,40.28 | 38.22,40.13 39.17,40.13 v39.3,40.25
  Bottom 1.397: 34.17,40.63 v34.17,47.88 34.17,49.41 4.C1.+ 32.73,49.82 | v68.17,27.13 v57.17,27.13 v46.67,27.13 v35.92,27.13 v31.17,27.38 | 75.3,40.26 v75.3,40.38 75.17,40.38 | v31.17,27.38 v32.67,27.38 | v29.92,27.38 v31.17,27.38 | v50.17,40.18 v64.3,40.13 75.17,40.13 | v50.17,40.18 53.3,40.13 v53.3,40 | v50.17,40.18 39.3,40.13 38.22,40.13 35.67,40.13 | 75.17,40.38 75.17,40.88 | v31.17,49.88 31.23,49.82 32.73,49.82 | 75.17,40.13 75.17,39.63 35.17,39.63 34.67,40.13 | 35.67,40.13 35.17,40.13 | 35.17,40.13 34.42,40.88 | 32.73,49.82 33.67,48.88 33.67,42.13 | 33.67,42.13 35.67,40.13 | 34.67,40.13 35.17,40.13 | 34.17,40.63 33.67,41.13 33.67,42.13 | 34.17,40.63 34.67,40.13 | 75.17,40.13 75.17,40.38 | 75.17,40.13 74.92,39.88
N$1
  Top 0.254: 9.IC0.17 41.74,18.46 9.C1.1
N$2
  Top 0.254: 2.IC0.3 33.77,43.73 33.17,43.13 33.16,38.05 40.16,38.05 | 2.IC2.1 40.31,38 40.16,38.05 | 2.R0.1 42.6,36.56 41.92,35.88 40.92,35.88 40.3,36.5 40.3,37.88 40.16,38.05
N$3  (via drill 0.3)
  Top 0.254: 9.IC0.16 38.48,17.81 37.67,17 v37.67,16.13
  Bottom 0.254: v37.67,16.13 37.67,13.54 9.CON0.D-
N$4  (via drill 0.3)
  Top 0.254: v39.8,16.38 9.IC0.15
  Bottom 0.254: v39.8,16.38 39.8,13.13 40.17,12.75 40.17,11.4 9.CON0.D+
N$5
  Top 0.254: 9.CON0.VCC 41.49,13.78 9.R1.2
N$6
  Top 0.254: 9.IC0.19 38.06,19.76 36.3,18 36.3,14.75 9.R2.2 9.R1.1
N$7
  Top 0.254: 3.IC0.3 45.9,40.61 45.67,40.38 44.42,40.38 44.17,40.13 44.17,37.96 50.08,37.96 3.IC2.1 51.17,39.05 51.17,36.63 51.42,36.38 52.42,36.38 53.21,37.17 3.R0.1
N$8  (via drill 0.3)
  Top 0.254: 2.IC1.3 42.48,43.78 2.R1.1 42.42,43.63 41.3,42.5 41.3,37.38 v41.05,37.13 | 2.IC3.1 33.51,28.94 33.22,29.23 v33.22,31.18
  Bottom 0.254: v41.05,37.13 41.05,31.75 40.47,31.18 v33.22,31.18
N$9
  Top 0.533: 2.CON0.M- 39.29,33.26 2.IC5.3 2.IC3.3
N$10
  Top 0.533: 2.IC2.3 2.IC4.3 35.01,35 2.CON0.M+
N$11  (via drill 0.3)
  Top 0.254: 52.92,43.78 3.IC1.3 | 52.92,43.78 53.31,43.78 3.R1.1 | 3.IC3.1 44.91,28.89 v42.92,30.88 | 52.92,43.78 53.07,43.63 53.07,43.4 52.14,42.39 52.13,37.97 v51.92,37.5
  Bottom 0.254: v42.92,30.88 51.17,30.88 51.92,31.63 v51.92,37.5
N$12
  Top 0.533: 3.CON0.M- 49.17,32.17 3.IC5.3 45.9,31.07 3.IC3.3
N$13  (via drill 0.3)
  Top 0.254: v96.09,50.84 96.72,50.21 96.72,47.73 97.27,47.18 97.97,47.18 99.7,45.45 10.R0.2
  Bottom 0.254: 10.LCD0.3 65.95,50.83 83.04,50.84 83.73,50.84 84.97,52.08 94.85,52.08 v96.09,50.84
N$14
  Top 0.533: 3.IC4.3 46.02,34.87 3.CON0.M+ | 3.IC4.3 | 3.IC2.3 50.24,36.7 49.67,36.13 46.75,36.13 3.IC4.3
N$15
  Top 0.254: 11.IC0.EMITTER 82.92,10.53 11.CON0.4 85.22,8.23 11.IC1.EMITTER 88.37,6.03 89.17,5.23 89.17,2.83 88.17,1.83 11.CON0.1
N$16
  Top 0.813: 10.IC0.5 84.92,51.25 86.05,53 87.67,54.63 92.86,54.63 10.C1.+
N$17
  Top 0.254: 10.IC0.3 86.93,46.63
  Top 0.813: 86.93,46.63 88.05,47.75 88.05,51.9 89.27,53.13 92.92,53.13 10.C1.-
N$18
  Top 0.254: 4.IC0.3 56.83,40.54 56.67,40.38 55.17,40.38 55.17,38.25 55.41,38.05 62.18,38.05 4.IC2.1 62.17,39.11 62.17,36.63 62.42,36.38 63.67,36.38 64.41,37.12 4.R0.1
N$19  (via drill 0.3)
  Top 0.254: v62.92,37.38 62.92,37.88 63.1,38.15 63.1,42.6 63.42,43.13 63.92,43.63 4.R1.1 | 4.R1.1 64.46,43.63 | 4.IC1.3 61.57,43.78 62.17,44.38 63.52,44.38 4.R1.1 | v53.55,31.13 53.55,30.5 55.17,28.88 55.77,28.88 4.IC3.1
  Bottom 0.254: v62.92,37.38 62.42,36.88 62.42,32.63 62.17,32.38 53.92,32.38 53.42,31.88 53.42,31.25 v53.55,31.13
N$20
  Top 0.533: 4.IC3.3 61.1,31.06 4.IC5.3 61.14,33.09 4.CON0.M-
N$21
  Top 0.533: 4.IC2.3 57.03,36.94 4.IC4.3 57.01,34.68 4.CON0.M+
N$22  (via drill 0.3)
  Top 0.254: 7.65,23.65 IC1.1 | 9.R5.2 12.06,15.38
  Top 0.533: v8.67,22.63 7.65,23.65 | 12.06,15.38 v13.67,15.38 14.54,14.51 9.R6.2
  Top 0.813: 9.R5.2 12.C11.1
  Bottom 0.254: v13.67,15.38 13.62,15.43
  Bottom 0.533: v8.67,22.63 8.67,18.77 12.01,15.43 13.62,15.43
N$23  (via drill 0.3)
  Top 0.254: v83.82,46.58 84.87,46.58 10.IC0.1 | 101.4,40.48 101.06,40.82
  Top 0.813: 10.C0.- 101.4,40.48 v101.4,41.03 101.4,45.4 v101.37,45.43
  Bottom 0.254: v83.82,46.58 87.22,46.58 90.52,49.88 93.52,49.88 94.67,48.73 94.67,48.33 95.62,47.38 98.27,47.38 99.92,45.73 100.07,45.58 100.22,45.43 v101.37,45.43 | 10.R0.1 101.07,40.7 v101.4,41.03
N$24
  Top 0.254: 5.IC0.3 67.69,40.6 67.59,40.5 66.22,40.5 66,40.19 66,38.25 66.2,38.05 73.04,38.05 | 73.04,38.05 5.IC2.1 | 5.R0.1 75.29,36.99 74.62,36.32 73.25,36.32 73.03,36.54 73.03,38.04 73.04,38.05
N$25  (via drill 0.3)
  Top 0.254: v73.81,37.19 74,37.56 74,42.09 74.16,42.34 74.16,42.92 74.94,43.64 5.R1.1 74.79,44.46 73.23,44.46 72.48,43.8 5.IC1.3 | v65.39,31.16 65.39,29.72 5.IC3.1
  Bottom 0.254: v65.39,31.16 66.01,32.03 72.42,32.06 73.3,32.93 73.3,36.75 73.73,37.19 v73.81,37.19
N$26
  Top 0.533: 5.CON0.M- 71.32,31.71 5.IC5.3 67.79,30.97 5.IC3.3
N$27
  Top 0.533: 5.IC2.3 67.88,36.95 5.IC4.3 67.84,35.2 5.CON0.M+
N$28  (1 unrouted)
  Bottom 0.533: 0.C4.1 90.07,32.69
N$29
  Top 0.254: 5.17,23.9 IC1.3
  Top 0.406: 5.17,23.9 5.17,22.38 4.42,21.88 2.42,21.88 1.67,22.63 1.32,22.98 1.32,27.58 1.79,28.05 12.C10.1
N$30  (via drill 0.3)
  Top 0.254: 12.C8.2
  Top 0.533: 12.R1.1 12.C8.2 | 12.R2.2 3.57,34.93 | v7.67,16.88 7.67,18.24 IC1.8
  Top 1.27: 3.57,34.93 12.R1.1
  Top 1.397: 12.R2.2 3.08,34.54 3.42,34.88 5.42,34.88 5.67,34.63 5.67,30.13 v5.92,29.88
  Bottom 0.533: v5.92,29.88 5.92,18.38 v7.67,16.88
N$31
  Top 0.254: 11.IC0.COLLECTOR 79.76,7.54 11.CON0.3
N$32
  Top 0.254: 12.C10.2 3.13,26.14
  Top 0.533: 10.03,26.49 10.03,27.47 10.02,27.48
  Top 0.813: IC1.4 3.84,25.25 12.C10.2
  Top 1.27: 3.13,26.14 9.72,26.18 10.03,26.49 12.L1.P$1 | 10.02,27.48 9.77,27.48 9.32,27.03 5.02,27.03 4.32,26.33
N$33
  Top 0.254: 10.1,15.44 9.R5.1 12.C12.1
N$34
  Top 0.254: 11.CON0.2 84.67,5.13 86.42,3.38 87.33,3.38 11.IC1.COLLECTOR
N$35  (1 unrouted)
N$36
  Top 0.254: 12.C9.+ 10.92,5.96
  Top 0.533: IC1.7 6.38,13.92 10.92,9.38 10.92,5.96
N$37
  Top 0.254: 87.98,11.13 11.IC0.ANODE 86.57,12.54 86.57,15.23 87.97,16.63 11.R0.1
N$38
  Top 0.254: 11.IC1.ANODE 95.48,3.63 91.92,3.63 88.97,6.58 88.97,12.23 90.55,13.81 11.R1.1
PA00(TXD0)  (via drill 0.3)
  Top 0.254: 9.IC0.5 34.79,23.01 35.3,22.5 35.3,19.88 v35.42,19.75 | 82.8,17.38 v82.3,16.88 82.82,17.4 82.82,31.48 83.76,32.42 0.MCU1.11
  Bottom 0.254: v35.42,19.75 61.05,19.75 64.07,16.73 82.07,16.73 82.22,16.88 v82.3,16.88
PA01(RXD0)  (via drill 0.3)
  Top 0.254: 9.IC0.1 34.44,25.61 35.67,25.63 v36.05,25.25 | 0.MCU1.14 86.94,28.95 86.17,28.18 v86.17,20.53
  Bottom 0.254: v36.05,25.25 36.42,25.25 37.17,24.5 61.3,24.5 63.55,22.25 68.17,22.25 69.67,20.75 76.3,20.75 76.92,21.38 79.67,21.38 80.52,20.53 v86.17,20.53
PA02(RTS0)  (via drill 0.3)
  Top 0.254: 9.IC0.11 33.69,19.11 v34.67,19.13 | 0.MCU1.13 86.43,29.74 85.62,28.93 85.62,21.28 85.32,20.98 85.32,17.28 v84.17,16.13
  Bottom 0.254: v84.17,16.13 63.37,16.13 60.5,19 48.17,19 36.46,19.11 36.45,19.11 36.27,18.93 34.87,18.93 v34.67,19.13
PA03(CTS0)  (via drill 0.3)
  Top 0.254: 9.IC0.3 35.86,24.31 v36.3,23.88 | 0.MCU1.4 85.95,35.97 86.17,35.75 86.17,31.63 85.77,31.23 84.77,31.23 84.12,30.58 84.12,19.98 84.37,19.73 v84.42,19.73
  Bottom 0.254: v36.3,23.88 60.92,23.88 63.55,21.25 67.92,21.25 69.3,19.88 77.17,19.88 78.57,18.48 80.07,18.48 81.32,19.73 v84.42,19.73
PA04(MISO)
  Top 0.254: 0.MCU1.28 95.77,33.43 96.42,32.78 96.42,29.08 94.37,27.03 94.37,15.53 94.82,15.08 94.82,12.33 95.22,11.93 97.97,11.93 99.2,13.15 6.IC0.2
PA05(MOSI)  (via drill 0.3)
  Top 0.254: 0.MCU1.12 84.25,31.91 83.62,31.28 v83.62,18.73 | 6.IC0.5 101.74,17.57 v101.17,17
  Bottom 0.254: v101.17,17 100.42,17.63 99.3,17.63 98.07,16.41 93.24,16.41 91.18,18.47 91.18,18.49 91.17,18.48 83.92,18.48 83.67,18.73 v83.62,18.73
PA06(SCK)  (via drill 0.3)
  Top 0.254: 0.MCU1.10 83.37,32.93 82.27,31.83 82.27,19.18 v81.82,18.73 | 6.IC0.6 100.47,17.92 99.77,17.23 99.77,16.6 v99.67,16.5
  Bottom 0.254: v99.67,16.5 98.92,15.75 93,15.75 90.92,17.83 90.92,17.88 83.32,17.88 82.48,18.73 v81.82,18.73
PA07(NPCS0)  (via drill 0.3)
  Top 0.254: 0.MCU1.15 87.44,30.3 87.44,24.06 88.27,23.23 v88.27,20.43 | v97.17,17.3 97.17,14.56 6.IC0.1
  Bottom 0.254: v97.17,17.3 93.37,17.3 91.17,19.5 89.2,19.5 v88.27,20.43
PA08
  Top 0.254: 0.MCU1.3 82.82,36.48 82.55,36.75 82.55,54.25 82.05,54.75 79.36,54.75 10.LCD0.16
PA09  (via drill 0.3)
  Top 0.254: 0.MCU1.2 83.69,36.99 v83.3,37.38 | v76.27,4 76.27,8.63 77.72,10.08 77.72,12.93 76.62,14.03 76.62,37.28 v76.72,37.38
  Bottom 0.254: 1.ENC1.A 22.29,4.01 23.92,2.38 51.05,2.38 52.05,1.38 73.55,1.38 76.17,4 v76.27,4 | v76.72,37.38 v83.3,37.38
PA10  (via drill 0.3)
  Top 0.254: 0.MCU1.46 87.45,41.35 v87.17,41.75 | v78.05,4.75 78.67,5.38 78.67,15 80.3,16.63 80.3,31.8 79.3,32.8 v79.3,41.38
  Bottom 0.254: 1.ENC1.B 27.29,4.01 28.17,3.13 51.17,3.13 52.42,2 72.92,2 75.8,4.75 v78.05,4.75 | v87.17,41.75 79.67,41.75 v79.3,41.38
PA11  (via drill 0.3)
  Top 0.254: 1.ENC2.B 27.28,30.24 25.8,28.75 v25.8,16.75 | 0.MCU1.27 95.12,32.93 95.82,32.23 95.82,29.43 93.82,27.43 93.82,14.4 v94.07,14.15
  Bottom 0.254: v25.8,16.75 28.67,16.75 29.67,17.75 47.17,17.75 49.3,15.63 53.3,15.63 55.3,13.75 60.42,13.75 61.55,14.88 83.47,14.88 | 83.47,14.88 83.55,14.88 | 83.47,14.88 83.77,14.58 88.92,14.58 89.57,13.93 93.85,13.93 v94.07,14.15 93.95,14.03
PA12  (via drill 0.3)
  Top 0.254: 0.MCU1.47 86.94,40.49 v86.67,40.85 | 1.SW_LM_1.1 100.79,29.49 100.79,33.41 100.3,33.9 v100.3,39.43 | v91.98,15.69 91.98,27.07 v91.95,27.13
  Bottom 0.254: v91.98,15.69 90.44,17.24 83.21,17.24 82.72,17.73 81.32,17.73 80.87,17.28 68.02,17.28 67.17,18.13 67.17,18.14 1.ENC3.SW1 | 1.SW_LM_1.1 98.52,27.13 v91.95,27.13 | v86.67,40.85 88.65,40.85 89.32,41.53 90.92,41.53 91.32,41.13 93.57,41.13 95.27,39.43 v100.3,39.43
PA13  (via drill 0.3)
  Top 0.254: 1.ENC2.A 22.28,31.52 23.55,30.25 23.55,16.13 v23.92,15.75 | 0.MCU1.26 94.83,32.42 95.27,31.98 95.27,29.73 93.27,27.73 93.27,12.98 v93.25,13.2
  Bottom 0.254: v23.92,15.75 28.8,15.75 30.17,17.13 44.8,17.13 49.17,12.75 51.55,12.75 51.97,13.18 60.87,13.18 61.82,14.13 77.22,14.13 78.97,12.38 89.32,12.38 90.32,13.38 92.97,13.38 93.15,13.2 v93.25,13.2
PA14  (via drill 0.3)
  Top 0.254: v24.67,18.38 24.67,29 26.11,30.49 26.11,33.93 22.28,37.81 1.ENC2.SW1 | 0.MCU1.36 95.67,37.5 v95.92,37.5 | 1.SW_LM_2.1 99.52,37.38 v99.47,37.43 | v92.47,14.63 92.72,14.88 92.72,27.98 93.32,28.58 v93.32,29.63
  Bottom 0.254: v24.67,18.38 25.67,18.38 26.42,17.63 28.3,17.63 29.05,18.38 47.8,18.38 49.67,16.38 54.05,16.38 56.17,14.38 60.05,14.38 61.17,15.5 83.7,15.5 84.07,15.13 89.77,15.13 90.27,14.63 v92.47,14.63 | 93.3,29.63 v93.32,29.63 97.56,29.63 97.56,29.65 1.SW_LM_2.1 | v99.47,37.43 96,37.43 v95.92,37.5
PA15  (via drill 0.3)
  Top 0.254: v79.67,43.58 80.32,42.93 80.32,35.98 79.97,35.63 79.97,33.28 80.82,32.43 80.82,16.53 84.37,12.98 v84.37,10.13 | v93.82,43.13 93.82,41.03 92.02,39.23 0.MCU1.37
  Bottom 0.254: 1.ENC3.A 66.53,5.36 67.92,6.75 77.87,6.75 77.85,6.78 77.82,6.78 81.17,10.13 v84.37,10.13 | 93.52,43.18 93.77,43.18 v93.82,43.13 93.52,43.13 93.47,43.18 92.67,43.18 92.62,43.13 80.17,43.13 79.72,43.58 v79.67,43.58 80.07,43.18
PA16  (via drill 0.3)
  Top 0.254: 1.ENC1.SW2 29.05,20.59 v28.55,20.63 28.55,33.13 28.51,33.13 25.11,36.53 25.11,44.08 1.ENC2.SW2 | 78.42,42 v78.42,41.98 78.42,40.78 78.77,40.43 78.77,25.85 77.55,24.63 v77.55,18.13 | 0.MCU1.38 91.51,39.67 92.87,41.03 v93.02,42.43
  Bottom 0.254: v28.55,20.63 29.3,20.38 34.72,20.38 34.97,20.63 36.47,20.63 36.72,20.38 67.3,20.38 68.9,18.78 1.ENC3.SW2 72.18,18.13 v77.55,18.13 | v93.02,42.43 91.82,42.43 91.67,42.58 79.02,42.58 v78.42,41.98
PA17  (via drill 0.3)
  Top 0.254: 10.LCD0.4 64.76,54.79 65.3,54.25 v65.3,50.13 65.3,49.63 | 0.MCU1.39 91,39.96 91.3,40.25 91.3,42.3 94.67,45.68 v94.67,50.83
  Bottom 0.254: v94.67,50.83 94.07,51.43 88.52,51.43 87.22,50.13 v65.3,50.13
PA18  (via drill 0.3)
  Top 0.254: 10.LCD0.6 66.89,54.79 67.92,53.75 v67.92,49.4 67.92,49.25 | 0.MCU1.41 89.99,39.71 89.32,40.38 89.32,42.68 88.92,43.08 88.92,50.33 v89.22,50.63
  Bottom 0.254: 87.85,49.66 87.84,49.66 | 87.85,49.66 88.82,50.63 v89.22,50.63 | v67.92,49.4 87.6,49.4 87.85,49.66
PA19  (via drill 0.3)
  Top 0.254: 0.MCU1.40 90.5,40.7 v90.42,40.78 | v103.72,37.88 103.72,19.43 v103.37,19.08 | v90.72,20.43 90.72,18.67 11.R1.2
  Bottom 0.254: v103.37,19.08 92.97,19.08 91.52,20.53 90.82,20.53 v90.72,20.43 | v103.72,37.88 103.27,38.33 95.12,38.33 92.87,40.58 90.82,40.58 90.62,40.78 v90.42,40.78
PA20  (via drill 0.3)
  Top 0.254: 0.MCU1.25 94.02,31.91 v94.47,31.5 | 10.LCD0.11 74.24,48.83 v77.61,45.46 | v98.32,43.23 98.42,43.13 98.42,34.93 v98.55,34.8
  Bottom 0.254: v77.61,45.46 81.38,45.46 82.8,44.04 82.81,44.04 83.17,43.68 92.42,43.68 92.47,43.73 93.27,43.73 93.42,43.88 94.22,43.88 94.77,43.33 98.32,43.33 v98.32,43.23 | v94.47,31.5 94.5,31.48 95.52,31.48 98.55,34.5 v98.55,34.8
PA21  (via drill 0.3)
  Top 0.254: 10.LCD0.12 74.39,54.79 75.42,53.75 75.42,50.61 78.67,47.36 78.67,43.58 77.62,42.53 77.62,40.53 78.17,39.98 78.17,30.22 77.92,29.97 v77.92,29.62 | 0.MCU1.24 92.02,29.06 v92.32,28.75
  Bottom 0.254: v92.32,28.75 92.17,28.75 91.78,29.14 91.42,29.5 91.3,29.62 v77.92,29.62
PA22
  Top 0.254: 10.LCD0.13 76.67,52.14 76.67,50.5 80.54,46.63 80.54,44.11 80.87,43.78 80.87,35.41 80.54,35.08 80.54,33.62 80.99,33.17 81.69,33.17 81.96,33.43 0.MCU1.9
PB00
  Top 0.254: 10.LCD0.14 76.78,54.02 77.92,52.88 77.92,51.25 78.3,50.88 80.8,50.88 82,49.68 82,35.43 82.47,34.96 0.MCU1.6
PB01  (via drill 0.3)
  Top 0.254: 4.IC0.1 55.88,42.09 | 4.R3.2 57.8,45.99 57.8,45.25 57.42,44.88 56.17,44.88 55.67,44.38 55.67,41.79 4.IC0.1 | 4.IC0.1 54.58,40.68 54.54,30.53 55.17,29.95 60.05,29.95 60.17,29.88 60.17,28.84 4.IC5.1 60.19,28.61 62.17,26.63 62.17,25.13 v62.92,24.38 | 0.MCU1.16 87.96,25.18 88.26,24.88 v88.47,24.88
  Bottom 0.254: v88.47,24.88 78.17,24.88 77.92,24.63 63.17,24.63 v62.92,24.38
PB02  (via drill 0.3)
  Top 0.254: 4.IC4.1 60.27,41.47 4.IC1.1 59.99,41.86 59.99,44.68 60.2,44.89 61.96,44.89 62.17,45.1 62.17,45.95 | 62.17,45.95 4.R2.2 | 62.17,45.95 v62.17,48.25 | 0.MCU1.7 82.1,34.45 81.42,35.13 81.42,47.5 81.05,47.88 v80.55,47.88
  Bottom 0.254: v80.55,47.88 80.3,48.13 62.37,48.13 62.3,48.05 62.3,48.13 v62.17,48.25
PB03  (via drill 0.3)
  Top 0.254: 5.R3.2 68.81,45.15 68.51,44.94 67.08,44.94 66.8,44.57 5.IC0.1 66.05,41.6 65.46,41.01 65.46,35.82 66.6,34.68 66.6,30.32 67.01,29.91 70.8,29.91 71.11,29.6 | 71.11,29.6 5.IC5.1 71.11,29.07 | 0.MCU1.8 81.61,33.94 v81.34,34.08 | 71.11,29.6 71.4,29.88 72.93,29.88 73.05,30 73.05,32.63 73.95,33.53 v74.82,33.53
  Bottom 0.254: v81.34,34.08 81.34,34 80.87,33.53 v74.82,33.53
PB04  (via drill 0.3)
  Top 0.254: 5.IC4.1 71.14,41.54 5.IC1.1 71.14,44.61 71.37,44.89 72.87,44.89 73.07,45.04 73.07,46 5.R2.2 73.07,46.13 75.55,46.13 77.02,44.65 77.02,40.23 77.57,39.68 77.57,30.53 77.17,30.13 77.17,28.98 v77.62,28.53 77.67,28.48 | 0.MCU1.21 90.5,28.98 v90.07,28.55
  Bottom 0.254: v90.07,28.55 77.65,28.5 v77.62,28.53
PB05  (via drill 0.3)
  Top 0.254: 2.IC0.1 34.05,41.57 34.05,42 34.67,42.63 36.12,42.63 36.37,42.92 36.37,44.47 36.23,44.88 34.18,44.88 2.R3.2 33.86,46.13 v32.3,46.13 | 0.MCU1.20 89.99,29.5 89.82,29.33 89.17,29.33 88.92,29.08 v88.92,26.75 | v44.87,25.58 44.85,25.58 43.17,27.25 39.17,27.25 38.34,28.08 2.IC5.1 38.37,28.96 38.37,29.48 37.82,30.03 34.22,30.03 33.97,30.28 33.97,35.78 33.17,36.58 33.16,36.58 v32.88,36.86
  Bottom 0.254: v32.3,46.13 32.3,41.13 33.13,39.74 33.13,38.24 33.13,37.23 33.13,37.11 v32.88,36.86 | v44.87,25.58 44.92,25.63 47.82,25.63 48.22,26.03 76.52,26.03 77.25,26.75 v88.92,26.75
PB06  (via drill 0.3)
  Top 0.254: 2.IC1.1 38.4,41.11 36.42,39.13 35.98,39.13 2.IC4.1 | 2.IC1.1 | 2.IC1.1 38.4,45.93 2.R2.2 38.41,46.87 39.03,47.48 v39.24,47.48 | v97.42,36.13 97.42,38.83 95.97,40.28 95.97,44.03 v96.37,44.43 | 0.MCU1.30 95.37,34.45 v95.7,34.78
  Bottom 0.254: v95.7,34.78 96.07,34.78 v97.42,36.13 | v39.24,47.48 76.57,47.48 77.17,46.88 81.67,46.88 84.32,44.23 92.32,44.23 92.37,44.28 93.07,44.28 93.22,44.43 v96.37,44.43
PB07  (via drill 0.3)
  Top 0.254: 3.R3.2 46.92,45.9 46.92,45.38 46.42,44.88 45.17,44.88 44.95,44.66 3.IC0.1 44.87,41.58 43.67,40.38 43.67,37.25 44.17,36.75 44.17,30.63 44.67,30 48.42,30 49.32,29.23 3.IC5.1 49.32,25.1 v49.3,25.25 | 0.MCU1.31 94.5,34.96 95.07,35.53 96.51,35.53 97.09,34.95 97.09,34.01 97.67,33.43 97.67,27.15 v96.8,26.28
  Bottom 0.254: v49.3,25.25 76.67,25.25 77.55,25.88 89.17,25.88 89.57,26.28 96.22,26.28 v96.8,26.28
PB08  (via drill 0.3)
  Top 0.254: 3.IC1.1 49.12,41.58 | 3.IC4.1 47.17,39.26 47.17,39.63 48.17,40.63 48.17,41.13 48.62,41.58 3.IC1.1 | 3.IC1.1 49.29,44.75 49.42,44.88 51.02,44.88 51.12,44.98 51.12,45.99 3.R2.2 51.29,46.16 51.29,47.87 v51.92,48.63 | 0.MCU1.32 93.56,35.47 93.57,35.48 94.27,35.48 95.07,36.28 95.97,36.28 96.67,36.98 96.67,38.48 94.62,40.53 94.62,44.18 95.5,45.05 v95.5,48.83
  Bottom 0.254: 51.96,48.67 v51.92,48.63 52.02,48.73 61.02,48.73 61.32,49.03 62.72,49.03 63.08,48.67 88.46,48.67 90.27,50.48 93.72,50.48 95.37,48.83 v95.5,48.83 95.47,48.68
PB09  (via drill 0.3)
  Top 0.254: 0.MCU1.29 96.21,33.94 96.97,33.18 96.97,28.78 94.92,26.78 94.92,16.08 95.67,15.38 v95.67,12.88
  Bottom 0.254: v95.67,12.88 95.67,10.25 93.67,8.25 93.65,8.25 93.07,7.68 87.52,7.68 86.07,9.13 84.27,9.13 83.97,9.43 81.57,9.43 78.42,6.28 78.42,6.13 72.17,6.13 71.55,5.5 71.55,4.29 1.ENC3.B
PB10
  Top 0.254: 0.MCU1.23 91.51,27.87 91.07,27.43 91.07,22.23 88.37,19.53 11.R0.2
PB11  (via drill 0.3)
  Top 0.254: 0.MCU1.44 88.46,41.84 v88.37,41.83 | v102.8,41.88 102.8,32.32 1.SW_LM_2.2 102.07,28.17 1.SW_LM_1.2
  Bottom 0.254: 88.42,41.93 v88.37,41.83 88.62,42.08 91.32,42.08 91.72,41.68 95.77,41.68 96.17,42.08 102.85,42.08 v102.8,41.88
PB12  (via drill 0.3)
  Top 0.254: 1.ENC1.SW1 22.29,15.39 29.55,8.13 29.55,4.63 v29.8,4.38 | 0.MCU1.5 83.83,35.47 v83.55,35.7 | v74.83,4.95 72.55,7.23 72.55,13.38 75.66,16.49 75.68,16.49 76.07,16.88 76.07,34.48 v75.74,34.81
  Bottom 0.254: v29.8,4.38 51.05,4.38 53.05,2.63 72.42,2.63 73.5,3.67 | 73.5,3.67 v74.83,4.95 74.78,4.95 73.5,3.67 | v75.74,34.81 75.67,34.75 | v75.74,34.81 76.32,35.34 | 76.32,35.34 76.47,35.48 76.7,35.7 v83.55,35.7 | v75.74,34.81 75.79,34.81 76.32,35.34

### Text on the board
tPlace: 2011 | TLCR REV.1 | SAVPEK ELECTRONICS | 8-16V DC POWER
Document: Doublecheck MCU pin order: CHECKED OK | Doublecheck design rules for PCB-CART: NOT TESTED | Motor power | XMOTOR | ROTATE MOTOR | Rotate speed | X Speed | Pic count | Top route direction | Bottom route direction
Changes: Move ENCODER values in correct layer in library. OK | Test lcd pad positions. | CAD version is correct, EAGLE incorrect. FIXED: NOK | Check connector outlines, either CAD images or Eagle part are incorrect. | USB, CAD version CORRECT, FIXED: NOK
PAD_TESTS: OK | OK | OK | OK | OK | OK | OK | OK | OK | OK | OK | OK